# Altium project PCB_LED_CALENDAR.PrjPcb
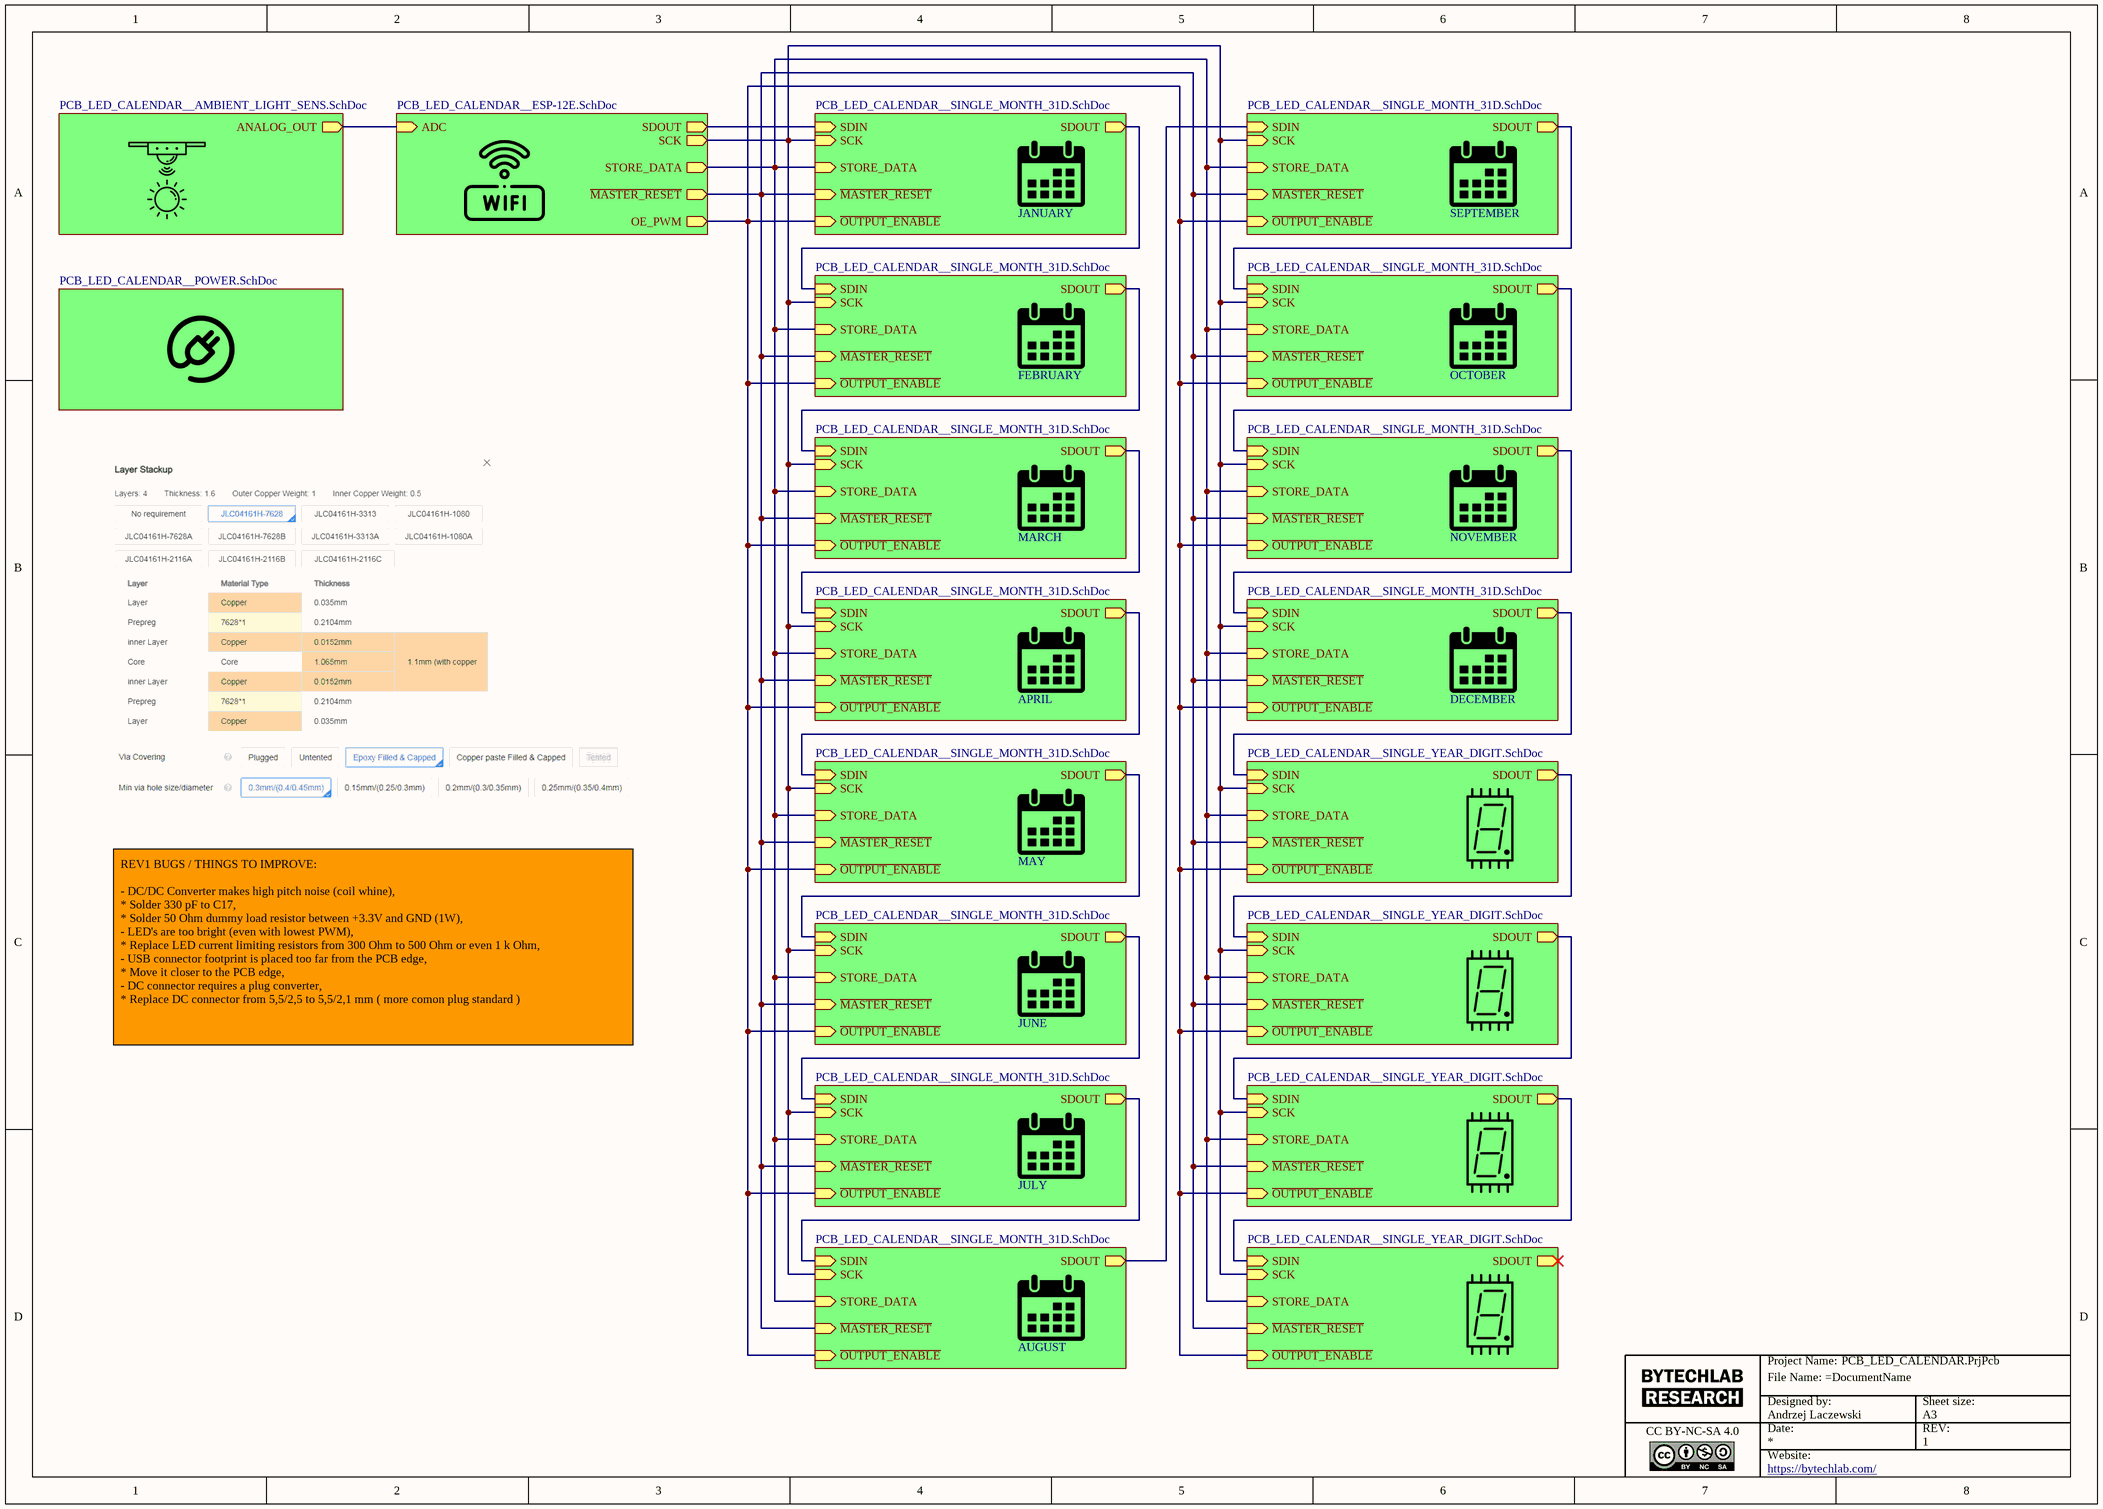
[diagram p0: PCB_LED_CALENDAR__MAIN.SchDoc]
AuthorGLobal: Andrzej Laczewski; CheckedByName: Adam Marszałek; Revision: 1; Title: LED CALENDAR
6 sheets, 947 parts. Net scope: hierarchical (ports join the sheet entries above them; power ports are global).
Board file: PCB_LED_CALENDAR.PcbDoc
Sheets:
  PCB_LED_CALENDAR__MAIN.SchDoc
    30D_3 = PCB_LED_CALENDAR__SINGLE_MONTH_31D.SchDoc
    31D_6 = PCB_LED_CALENDAR__SINGLE_MONTH_31D.SchDoc
    30D_4 = PCB_LED_CALENDAR__SINGLE_MONTH_31D.SchDoc
    31D_7 = PCB_LED_CALENDAR__SINGLE_MONTH_31D.SchDoc
    31D_5 = PCB_LED_CALENDAR__SINGLE_MONTH_31D.SchDoc
    31D_4 = PCB_LED_CALENDAR__SINGLE_MONTH_31D.SchDoc
    30D_2 = PCB_LED_CALENDAR__SINGLE_MONTH_31D.SchDoc
    31D_3 = PCB_LED_CALENDAR__SINGLE_MONTH_31D.SchDoc
    30D_1 = PCB_LED_CALENDAR__SINGLE_MONTH_31D.SchDoc
    31D_2 = PCB_LED_CALENDAR__SINGLE_MONTH_31D.SchDoc
    29D_1 = PCB_LED_CALENDAR__SINGLE_MONTH_31D.SchDoc
    31D_1 = PCB_LED_CALENDAR__SINGLE_MONTH_31D.SchDoc
    U_PCB_LED_CALENDAR__AMBIENT_LIGHT_SENS = PCB_LED_CALENDAR__AMBIENT_LIGHT_SENS.SchDoc
    U_PCB_LED_CALENDAR__POWER = PCB_LED_CALENDAR__POWER.SchDoc
    YD_1 = PCB_LED_CALENDAR__SINGLE_YEAR_DIGIT.SchDoc
    U_PCB_LED_CALENDAR__ESP-12E = PCB_LED_CALENDAR__ESP-12E.SchDoc
    YD_2 = PCB_LED_CALENDAR__SINGLE_YEAR_DIGIT.SchDoc
    YD_3 = PCB_LED_CALENDAR__SINGLE_YEAR_DIGIT.SchDoc
    YD_4 = PCB_LED_CALENDAR__SINGLE_YEAR_DIGIT.SchDoc

## Sheet PCB_LED_CALENDAR__MAIN.SchDoc: LED CALENDAR
size A3

### Sub-sheets
29D_1 = PCB_LED_CALENDAR__SINGLE_MONTH_31D.SchDoc: SDIN (in), SDOUT (out), ~{OUTPUT_ENABLE} (in), STORE_DATA (in), ~{MASTER_RESET} (in), SCK (in)
30D_1 = PCB_LED_CALENDAR__SINGLE_MONTH_31D.SchDoc: SDIN (in), SDOUT (out), ~{OUTPUT_ENABLE} (in), STORE_DATA (in), ~{MASTER_RESET} (in), SCK (in)
30D_2 = PCB_LED_CALENDAR__SINGLE_MONTH_31D.SchDoc: SDIN (in), SDOUT (out), ~{OUTPUT_ENABLE} (in), STORE_DATA (in), ~{MASTER_RESET} (in), SCK (in)
30D_3 = PCB_LED_CALENDAR__SINGLE_MONTH_31D.SchDoc: SDIN (in), SDOUT (out), ~{OUTPUT_ENABLE} (in), STORE_DATA (in), ~{MASTER_RESET} (in), SCK (in)
30D_4 = PCB_LED_CALENDAR__SINGLE_MONTH_31D.SchDoc: SDIN (in), SDOUT (out), ~{OUTPUT_ENABLE} (in), STORE_DATA (in), ~{MASTER_RESET} (in), SCK (in)
31D_1 = PCB_LED_CALENDAR__SINGLE_MONTH_31D.SchDoc: SDIN (in), SDOUT (out), ~{OUTPUT_ENABLE} (in), STORE_DATA (in), ~{MASTER_RESET} (in), SCK (in)
31D_2 = PCB_LED_CALENDAR__SINGLE_MONTH_31D.SchDoc: SDIN (in), SDOUT (out), ~{OUTPUT_ENABLE} (in), STORE_DATA (in), ~{MASTER_RESET} (in), SCK (in)
31D_3 = PCB_LED_CALENDAR__SINGLE_MONTH_31D.SchDoc: SDIN (in), SDOUT (out), ~{OUTPUT_ENABLE} (in), STORE_DATA (in), ~{MASTER_RESET} (in), SCK (in)
31D_4 = PCB_LED_CALENDAR__SINGLE_MONTH_31D.SchDoc: SDIN (in), SDOUT (out), ~{OUTPUT_ENABLE} (in), STORE_DATA (in), ~{MASTER_RESET} (in), SCK (in)
31D_5 = PCB_LED_CALENDAR__SINGLE_MONTH_31D.SchDoc: SDIN (in), SDOUT (out), ~{OUTPUT_ENABLE} (in), STORE_DATA (in), ~{MASTER_RESET} (in), SCK (in)
31D_6 = PCB_LED_CALENDAR__SINGLE_MONTH_31D.SchDoc: SDIN (in), SDOUT (out), ~{OUTPUT_ENABLE} (in), STORE_DATA (in), ~{MASTER_RESET} (in), SCK (in)
31D_7 = PCB_LED_CALENDAR__SINGLE_MONTH_31D.SchDoc: SDIN (in), SDOUT (out), ~{OUTPUT_ENABLE} (in), STORE_DATA (in), ~{MASTER_RESET} (in), SCK (in)
U_PCB_LED_CALENDAR__AMBIENT_LIGHT_SENS = PCB_LED_CALENDAR__AMBIENT_LIGHT_SENS.SchDoc: ANALOG_OUT (out)
U_PCB_LED_CALENDAR__ESP-12E = PCB_LED_CALENDAR__ESP-12E.SchDoc: ADC (in), SDOUT (out), SCK (out), OE_PWM (out), STORE_DATA (out), ~{MASTER_RESET} (out)
U_PCB_LED_CALENDAR__POWER = PCB_LED_CALENDAR__POWER.SchDoc: no entries
YD_1 = PCB_LED_CALENDAR__SINGLE_YEAR_DIGIT.SchDoc: SDIN (in), SDOUT (out), ~{OUTPUT_ENABLE} (in), STORE_DATA (in), ~{MASTER_RESET} (in), SCK (in)
YD_2 = PCB_LED_CALENDAR__SINGLE_YEAR_DIGIT.SchDoc: SDIN (in), SDOUT (out), ~{OUTPUT_ENABLE} (in), STORE_DATA (in), ~{MASTER_RESET} (in), SCK (in)
YD_3 = PCB_LED_CALENDAR__SINGLE_YEAR_DIGIT.SchDoc: SDIN (in), SDOUT (out), ~{OUTPUT_ENABLE} (in), STORE_DATA (in), ~{MASTER_RESET} (in), SCK (in)
YD_4 = PCB_LED_CALENDAR__SINGLE_YEAR_DIGIT.SchDoc: SDIN (in), SDOUT (out), ~{OUTPUT_ENABLE} (in), STORE_DATA (in), ~{MASTER_RESET} (in), SCK (in)

### Nets
NetMOD1_5: sheet 30D_3/SCK, sheet 31D_6/SCK, sheet 30D_4/SCK, sheet 31D_7/SCK, sheet 31D_5/SCK, sheet 31D_4/SCK, sheet 30D_2/SCK, sheet 31D_3/SCK, sheet 30D_1/SCK, sheet 31D_2/SCK, sheet 29D_1/SCK, sheet 31D_1/SCK, sheet YD_1/SCK, sheet U_PCB_LED_CALENDAR__ESP-12E/SCK, sheet YD_2/SCK, sheet YD_3/SCK, sheet YD_4/SCK
NetMOD1_6: sheet 30D_3/~{OUTPUT_ENABLE}, sheet 31D_6/~{OUTPUT_ENABLE}, sheet 30D_4/~{OUTPUT_ENABLE}, sheet 31D_7/~{OUTPUT_ENABLE}, sheet 31D_5/~{OUTPUT_ENABLE}, sheet 31D_4/~{OUTPUT_ENABLE}, sheet 30D_2/~{OUTPUT_ENABLE}, sheet 31D_3/~{OUTPUT_ENABLE}, sheet 30D_1/~{OUTPUT_ENABLE}, sheet 31D_2/~{OUTPUT_ENABLE}, sheet 29D_1/~{OUTPUT_ENABLE}, sheet 31D_1/~{OUTPUT_ENABLE}, sheet YD_1/~{OUTPUT_ENABLE}, sheet U_PCB_LED_CALENDAR__ESP-12E/OE_PWM, sheet YD_2/~{OUTPUT_ENABLE}, sheet YD_3/~{OUTPUT_ENABLE}, sheet YD_4/~{OUTPUT_ENABLE}
NetMOD1_7: sheet 31D_1/SDIN, sheet U_PCB_LED_CALENDAR__ESP-12E/SDOUT
NetMOD1_19: sheet 30D_3/~{MASTER_RESET}, sheet 31D_6/~{MASTER_RESET}, sheet 30D_4/~{MASTER_RESET}, sheet 31D_7/~{MASTER_RESET}, sheet 31D_5/~{MASTER_RESET}, sheet 31D_4/~{MASTER_RESET}, sheet 30D_2/~{MASTER_RESET}, sheet 31D_3/~{MASTER_RESET}, sheet 30D_1/~{MASTER_RESET}, sheet 31D_2/~{MASTER_RESET}, sheet 29D_1/~{MASTER_RESET}, sheet 31D_1/~{MASTER_RESET}, sheet YD_1/~{MASTER_RESET}, sheet U_PCB_LED_CALENDAR__ESP-12E/~{MASTER_RESET}, sheet YD_2/~{MASTER_RESET}, sheet YD_3/~{MASTER_RESET}, sheet YD_4/~{MASTER_RESET}
NetMOD1_20: sheet 30D_3/STORE_DATA, sheet 31D_6/STORE_DATA, sheet 30D_4/STORE_DATA, sheet 31D_7/STORE_DATA, sheet 31D_5/STORE_DATA, sheet 31D_4/STORE_DATA, sheet 30D_2/STORE_DATA, sheet 31D_3/STORE_DATA, sheet 30D_1/STORE_DATA, sheet 31D_2/STORE_DATA, sheet 29D_1/STORE_DATA, sheet 31D_1/STORE_DATA, sheet YD_1/STORE_DATA, sheet U_PCB_LED_CALENDAR__ESP-12E/STORE_DATA, sheet YD_2/STORE_DATA, sheet YD_3/STORE_DATA, sheet YD_4/STORE_DATA
NetQL1_2: sheet U_PCB_LED_CALENDAR__AMBIENT_LIGHT_SENS/ANALOG_OUT, sheet U_PCB_LED_CALENDAR__ESP-12E/ADC
NetU6_YD_1_9: sheet YD_1/SDOUT, sheet YD_2/SDIN
NetU6_YD_1_14: sheet 31D_7/SDOUT, sheet YD_1/SDIN
NetU6_YD_2_9: sheet YD_2/SDOUT, sheet YD_3/SDIN
NetU6_YD_3_9: sheet YD_3/SDOUT, sheet YD_4/SDIN
NetU12_29D_1_14: sheet 29D_1/SDIN, sheet 31D_1/SDOUT
NetU12_30D_1_14: sheet 30D_1/SDIN, sheet 31D_2/SDOUT
NetU12_30D_2_14: sheet 30D_2/SDIN, sheet 31D_3/SDOUT
NetU12_30D_3_14: sheet 30D_3/SDIN, sheet 31D_5/SDOUT
NetU12_30D_4_14: sheet 31D_6/SDOUT, sheet 30D_4/SDIN
NetU12_31D_2_14: sheet 31D_2/SDIN, sheet 29D_1/SDOUT
NetU12_31D_3_14: sheet 31D_3/SDIN, sheet 30D_1/SDOUT
NetU12_31D_4_14: sheet 31D_4/SDIN, sheet 30D_2/SDOUT
NetU12_31D_5_14: sheet 31D_5/SDIN, sheet 31D_4/SDOUT
NetU12_31D_6_14: sheet 30D_3/SDOUT, sheet 31D_6/SDIN
NetU12_31D_7_14: sheet 30D_4/SDOUT, sheet 31D_7/SDIN

### Notes on the sheet
- JANUARY
- SEPTEMBER
- FEBRUARY
- OCTOBER
- MARCH
- NOVEMBER
- APRIL
- DECEMBER
- MAY
- REV1 BUGS / THINGS TO IMPROVE:
  - DC/DC Converter makes high pitch noise (coil whine),
  * Solder 330 pF to C17,
  * Solder 50 Ohm dummy load resistor between +3.3V and GND (1W),
  - LED's are too bright (even with lowest PWM),
  * Replace LED current limiting resistors from 300 Ohm to 500 Ohm or even 1 k Ohm,
  - USB connector footprint is placed too far from the PCB edge,
  * Move it closer to the PCB edge,
  - DC connector requires a plug converter,
  * Replace DC connector from 5,5/2,5 to 5,5/2,1 mm ( more comon plug standard )
- JUNE
- JULY
- AUGUST
- Project Name:
- File Name: =DocumentName
- CC BY-NC-SA 4.0
- Designed by:
- Date:
- Website:
- Sheet size:
- A3
- REV:
- https://bytechlab.com/

## Sheet PCB_LED_CALENDAR__SINGLE_MONTH_31D.SchDoc: LED CALENDAR
size A3; Author: Andrzej Laczewski; DrawnBy: Andrzej Laczewski; SheetNumber: 3; SheetTotal: 4
Used 12 times, as channels 30D_3, 31D_6, 30D_4, 31D_7, 31D_5, 31D_4, 30D_2, 31D_3, 30D_1, 31D_2, 29D_1, 31D_1. Parts and nets are listed once, with the designators drawn on the sheet.
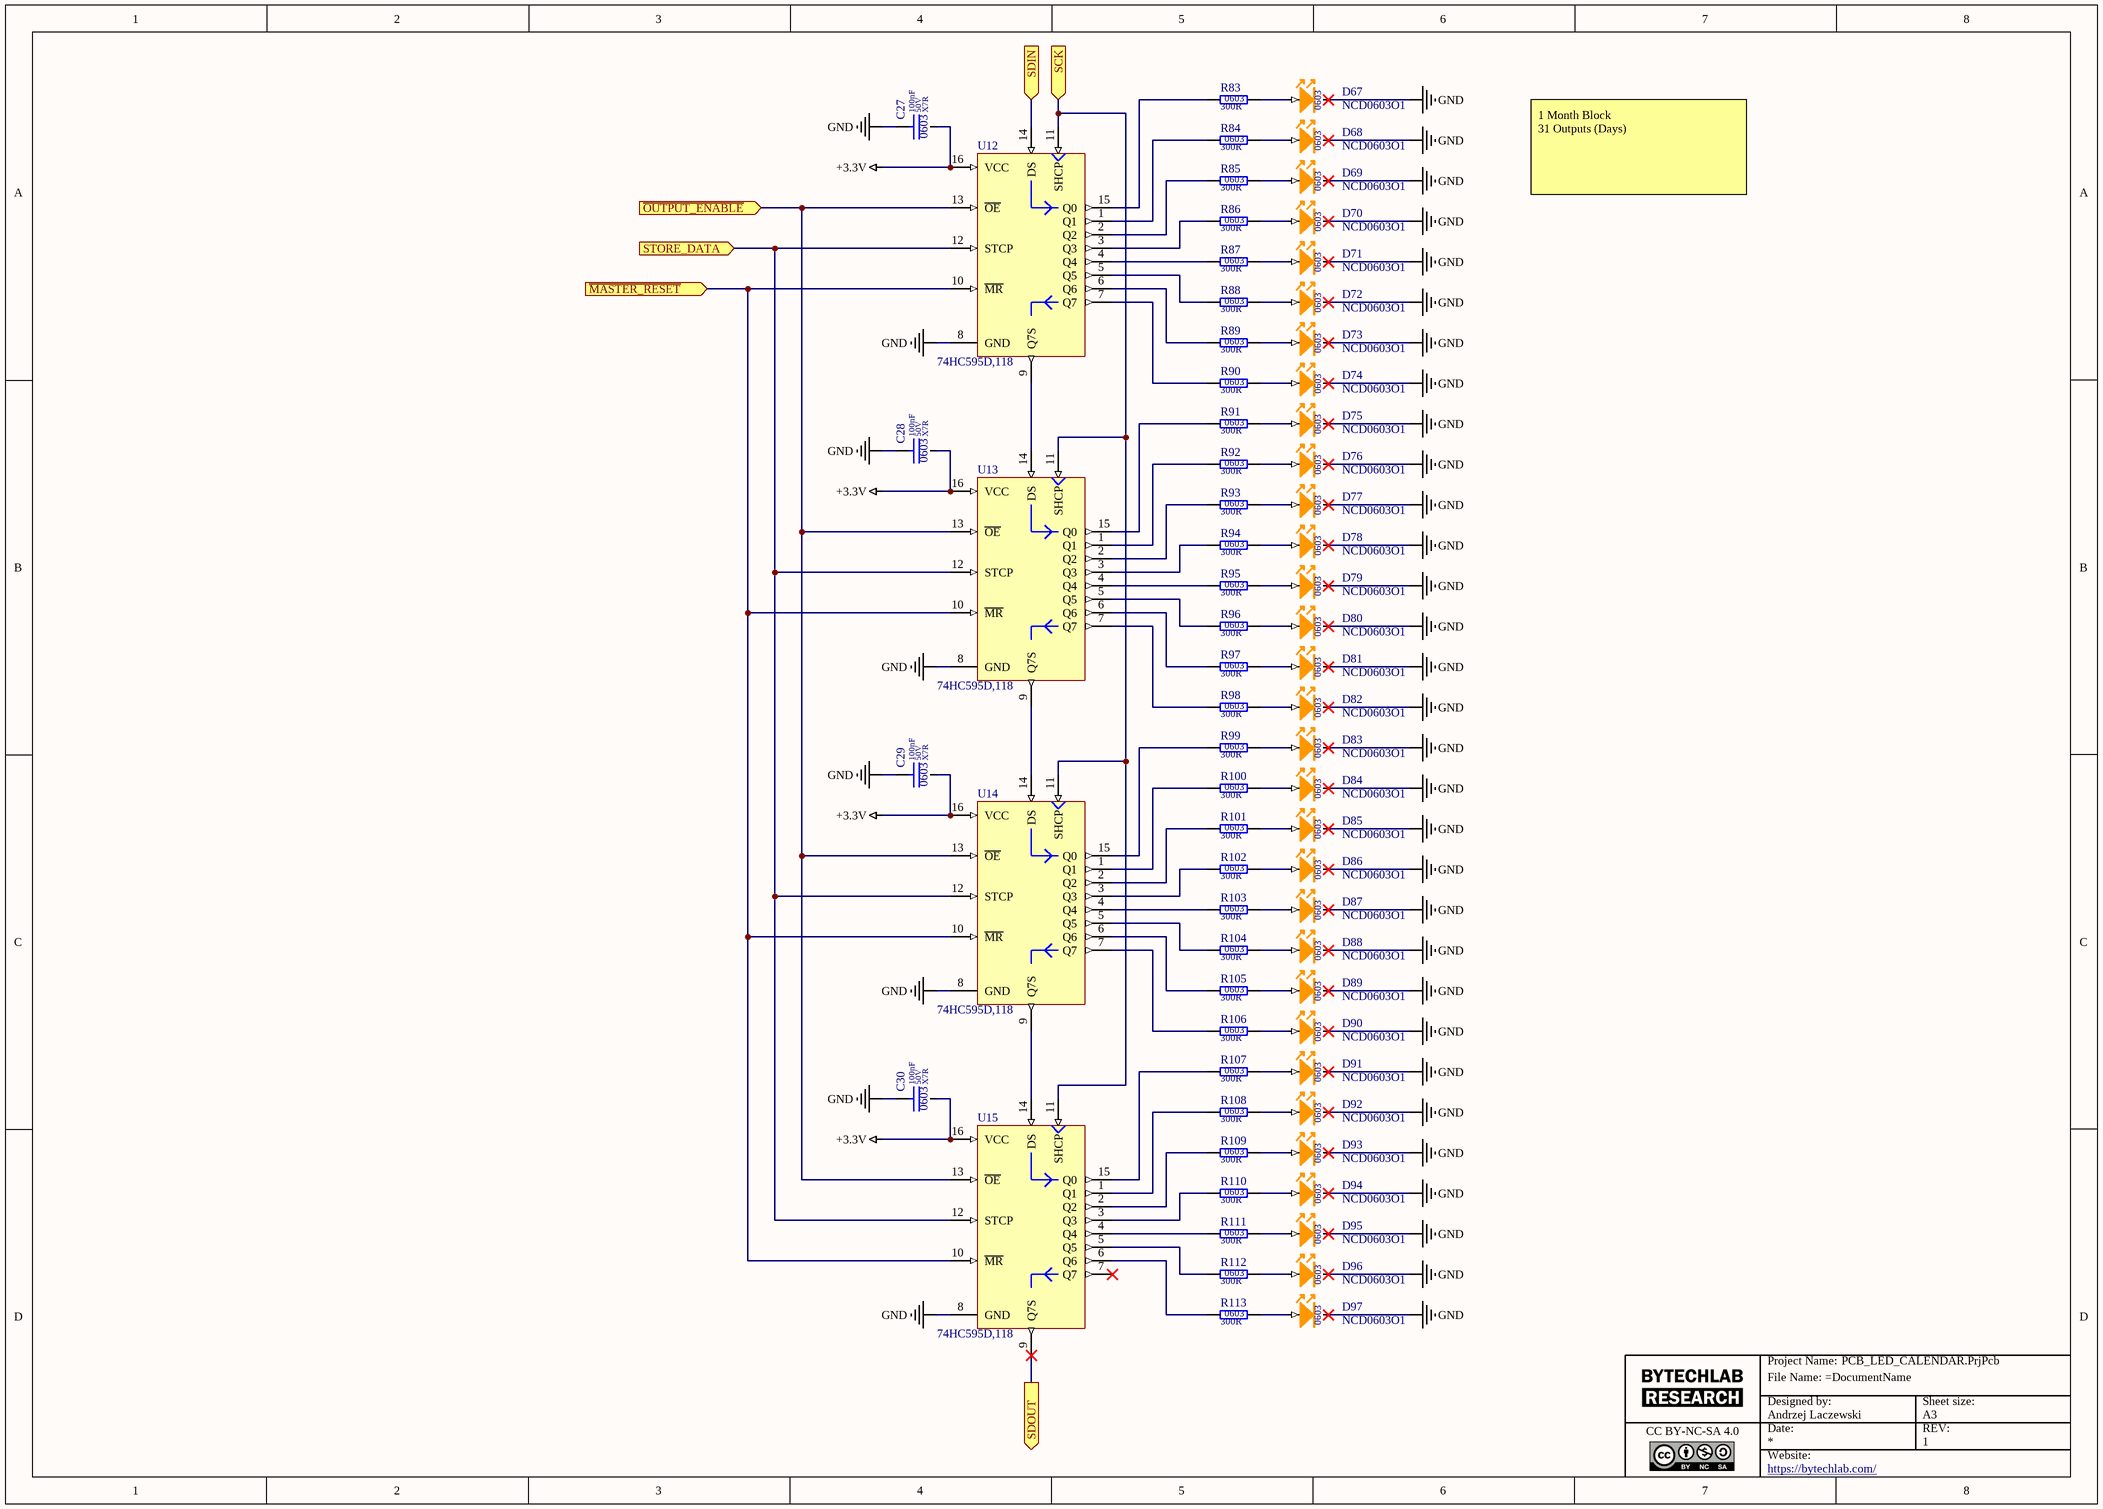
[diagram p1: PCB_LED_CALENDAR__SINGLE_MONTH_31D.SchDoc]

### Parts
C27  value 100nF  Dielectric: X7R  Voltage: 50V  SCH_Footprint: 0603  [C_0603_1608]  (hidden comment: Ceramic X7R)
C28  value 100nF  Dielectric: X7R  Voltage: 50V  SCH_Footprint: 0603  [C_0603_1608]  (hidden comment: Ceramic X7R)
C29  value 100nF  Dielectric: X7R  Voltage: 50V  SCH_Footprint: 0603  [C_0603_1608]  (hidden comment: Ceramic X7R)
C30  value 100nF  Dielectric: X7R  Voltage: 50V  SCH_Footprint: 0603  [C_0603_1608]  (hidden comment: Ceramic X7R)
D67  NCD0603O1  SCH_Footprint: 0603  [LED_0603]
D68  NCD0603O1  SCH_Footprint: 0603  [LED_0603]
D69  NCD0603O1  SCH_Footprint: 0603  [LED_0603]
D70  NCD0603O1  SCH_Footprint: 0603  [LED_0603]
D71  NCD0603O1  SCH_Footprint: 0603  [LED_0603]
D72  NCD0603O1  SCH_Footprint: 0603  [LED_0603]
D73  NCD0603O1  SCH_Footprint: 0603  [LED_0603]
D74  NCD0603O1  SCH_Footprint: 0603  [LED_0603]
D75  NCD0603O1  SCH_Footprint: 0603  [LED_0603]
D76  NCD0603O1  SCH_Footprint: 0603  [LED_0603]
D77  NCD0603O1  SCH_Footprint: 0603  [LED_0603]
D78  NCD0603O1  SCH_Footprint: 0603  [LED_0603]
D79  NCD0603O1  SCH_Footprint: 0603  [LED_0603]
D80  NCD0603O1  SCH_Footprint: 0603  [LED_0603]
D81  NCD0603O1  SCH_Footprint: 0603  [LED_0603]
D82  NCD0603O1  SCH_Footprint: 0603  [LED_0603]
D83  NCD0603O1  SCH_Footprint: 0603  [LED_0603]
D84  NCD0603O1  SCH_Footprint: 0603  [LED_0603]
D85  NCD0603O1  SCH_Footprint: 0603  [LED_0603]
D86  NCD0603O1  SCH_Footprint: 0603  [LED_0603]
D87  NCD0603O1  SCH_Footprint: 0603  [LED_0603]
D88  NCD0603O1  SCH_Footprint: 0603  [LED_0603]
D89  NCD0603O1  SCH_Footprint: 0603  [LED_0603]
D90  NCD0603O1  SCH_Footprint: 0603  [LED_0603]
D91  NCD0603O1  SCH_Footprint: 0603  [LED_0603]
D92  NCD0603O1  SCH_Footprint: 0603  [LED_0603]
D93  NCD0603O1  SCH_Footprint: 0603  [LED_0603]
D94  NCD0603O1  SCH_Footprint: 0603  [LED_0603]
D95  NCD0603O1  SCH_Footprint: 0603  [LED_0603]
D96  NCD0603O1  SCH_Footprint: 0603  [LED_0603]
D97  NCD0603O1  SCH_Footprint: 0603  [LED_0603]
R83  value 300R  SCH_Footprint: 0603  [R_0603_1608]  (hidden comment: Resistor)
R84  value 300R  SCH_Footprint: 0603  [R_0603_1608]  (hidden comment: Resistor)
R85  value 300R  SCH_Footprint: 0603  [R_0603_1608]  (hidden comment: Resistor)
R86  value 300R  SCH_Footprint: 0603  [R_0603_1608]  (hidden comment: Resistor)
R87  value 300R  SCH_Footprint: 0603  [R_0603_1608]  (hidden comment: Resistor)
R88  value 300R  SCH_Footprint: 0603  [R_0603_1608]  (hidden comment: Resistor)
R89  value 300R  SCH_Footprint: 0603  [R_0603_1608]  (hidden comment: Resistor)
R90  value 300R  SCH_Footprint: 0603  [R_0603_1608]  (hidden comment: Resistor)
R91  value 300R  SCH_Footprint: 0603  [R_0603_1608]  (hidden comment: Resistor)
R92  value 300R  SCH_Footprint: 0603  [R_0603_1608]  (hidden comment: Resistor)
R93  value 300R  SCH_Footprint: 0603  [R_0603_1608]  (hidden comment: Resistor)
R94  value 300R  SCH_Footprint: 0603  [R_0603_1608]  (hidden comment: Resistor)
R95  value 300R  SCH_Footprint: 0603  [R_0603_1608]  (hidden comment: Resistor)
R96  value 300R  SCH_Footprint: 0603  [R_0603_1608]  (hidden comment: Resistor)
R97  value 300R  SCH_Footprint: 0603  [R_0603_1608]  (hidden comment: Resistor)
R98  value 300R  SCH_Footprint: 0603  [R_0603_1608]  (hidden comment: Resistor)
R99  value 300R  SCH_Footprint: 0603  [R_0603_1608]  (hidden comment: Resistor)
R100  value 300R  SCH_Footprint: 0603  [R_0603_1608]  (hidden comment: Resistor)
R101  value 300R  SCH_Footprint: 0603  [R_0603_1608]  (hidden comment: Resistor)
R102  value 300R  SCH_Footprint: 0603  [R_0603_1608]  (hidden comment: Resistor)
R103  value 300R  SCH_Footprint: 0603  [R_0603_1608]  (hidden comment: Resistor)
R104  value 300R  SCH_Footprint: 0603  [R_0603_1608]  (hidden comment: Resistor)
R105  value 300R  SCH_Footprint: 0603  [R_0603_1608]  (hidden comment: Resistor)
R106  value 300R  SCH_Footprint: 0603  [R_0603_1608]  (hidden comment: Resistor)
R107  value 300R  SCH_Footprint: 0603  [R_0603_1608]  (hidden comment: Resistor)
R108  value 300R  SCH_Footprint: 0603  [R_0603_1608]  (hidden comment: Resistor)
R109  value 300R  SCH_Footprint: 0603  [R_0603_1608]  (hidden comment: Resistor)
R110  value 300R  SCH_Footprint: 0603  [R_0603_1608]  (hidden comment: Resistor)
R111  value 300R  SCH_Footprint: 0603  [R_0603_1608]  (hidden comment: Resistor)
R112  value 300R  SCH_Footprint: 0603  [R_0603_1608]  (hidden comment: Resistor)
R113  value 300R  SCH_Footprint: 0603  [R_0603_1608]  (hidden comment: Resistor)
U12  74HC595D,118  [SO16]
U13  74HC595D,118  [SO16]
U14  74HC595D,118  [SO16]
U15  74HC595D,118  [SO16]

### Ports
SCK (in), SDIN (in), SDOUT (out), STORE_DATA (in), ~{MASTER_RESET} (in), ~{OUTPUT_ENABLE} (in)

### Nets
+3.3V: C27.2 C28.2 C29.2 C30.2 U12.16(VCC) U13.16(VCC) U14.16(VCC) U15.16(VCC)
GND: C27.1 C28.1 C29.1 C30.1 D67.1(K) D68.1(K) D69.1(K) D70.1(K) D71.1(K) D72.1(K) D73.1(K) D74.1(K) D75.1(K) D76.1(K) D77.1(K) D78.1(K) D79.1(K) D80.1(K) D81.1(K) D82.1(K) D83.1(K) D84.1(K) D85.1(K) D86.1(K) D87.1(K) D88.1(K) D89.1(K) D90.1(K) D91.1(K) D92.1(K) D93.1(K) D94.1(K) D95.1(K) D96.1(K) D97.1(K) U12.8(GND) U13.8(GND) U14.8(GND) U15.8(GND)
~{MASTER_RESET}: U12.10(~{MR}) U13.10(~{MR}) U14.10(~{MR}) U15.10(~{MR}) ; port ~{MASTER_RESET}
~{OUTPUT_ENABLE}: U12.13(~{OE}) U13.13(~{OE}) U14.13(~{OE}) U15.13(~{OE}) ; port ~{OUTPUT_ENABLE}
SCK: U12.11(SHCP) U13.11(SHCP) U14.11(SHCP) U15.11(SHCP) ; port SCK
SDIN: U12.14(DS) ; port SDIN
SDOUT: U15.9(Q7S) ; port SDOUT
STORE_DATA: U12.12(STCP) U13.12(STCP) U14.12(STCP) U15.12(STCP) ; port STORE_DATA
NetD67_2: D67.2(A) R83.2
NetD68_2: D68.2(A) R84.2
NetD69_2: D69.2(A) R85.2
NetD70_2: D70.2(A) R86.2
NetD71_2: D71.2(A) R87.2
NetD72_2: D72.2(A) R88.2
NetD73_2: D73.2(A) R89.2
NetD74_2: D74.2(A) R90.2
NetD75_2: D75.2(A) R91.2
NetD76_2: D76.2(A) R92.2
NetD77_2: D77.2(A) R93.2
NetD78_2: D78.2(A) R94.2
NetD79_2: D79.2(A) R95.2
NetD80_2: D80.2(A) R96.2
NetD81_2: D81.2(A) R97.2
NetD82_2: D82.2(A) R98.2
NetD83_2: D83.2(A) R99.2
NetD84_2: D84.2(A) R100.2
NetD85_2: D85.2(A) R101.2
NetD86_2: D86.2(A) R102.2
NetD87_2: D87.2(A) R103.2
NetD88_2: D88.2(A) R104.2
NetD89_2: D89.2(A) R105.2
NetD90_2: D90.2(A) R106.2
NetD91_2: D91.2(A) R107.2
NetD92_2: D92.2(A) R108.2
NetD93_2: D93.2(A) R109.2
NetD94_2: D94.2(A) R110.2
NetD95_2: D95.2(A) R111.2
NetD96_2: D96.2(A) R112.2
NetD97_2: D97.2(A) R113.2
NetR83_1: R83.1 U12.15(Q0)
NetR84_1: R84.1 U12.1(Q1)
NetR85_1: R85.1 U12.2(Q2)
NetR86_1: R86.1 U12.3(Q3)
NetR87_1: R87.1 U12.4(Q4)
NetR88_1: R88.1 U12.5(Q5)
NetR89_1: R89.1 U12.6(Q6)
NetR90_1: R90.1 U12.7(Q7)
NetR91_1: R91.1 U13.15(Q0)
NetR92_1: R92.1 U13.1(Q1)
NetR93_1: R93.1 U13.2(Q2)
NetR94_1: R94.1 U13.3(Q3)
NetR95_1: R95.1 U13.4(Q4)
NetR96_1: R96.1 U13.5(Q5)
NetR97_1: R97.1 U13.6(Q6)
NetR98_1: R98.1 U13.7(Q7)
NetR99_1: R99.1 U14.15(Q0)
NetR100_1: R100.1 U14.1(Q1)
NetR101_1: R101.1 U14.2(Q2)
NetR102_1: R102.1 U14.3(Q3)
NetR103_1: R103.1 U14.4(Q4)
NetR104_1: R104.1 U14.5(Q5)
NetR105_1: R105.1 U14.6(Q6)
NetR106_1: R106.1 U14.7(Q7)
NetR107_1: R107.1 U15.15(Q0)
NetR108_1: R108.1 U15.1(Q1)
NetR109_1: R109.1 U15.2(Q2)
NetR110_1: R110.1 U15.3(Q3)
NetR111_1: R111.1 U15.4(Q4)
NetR112_1: R112.1 U15.5(Q5)
NetR113_1: R113.1 U15.6(Q6)
NetU12_9: U12.9(Q7S) U13.14(DS)
NetU13_9: U13.9(Q7S) U14.14(DS)
NetU14_9: U14.9(Q7S) U15.14(DS)

Not connected (* = marked no-connect by the designer): U15 7(Q7)*

### Channels
30D_3: designators end in _30D_3; ports SCK=NetMOD1_5 SDIN=NetU12_30D_3_14 SDOUT=NetU12_31D_6_14 STORE_DATA=NetMOD1_20 ~{MASTER_RESET}=NetMOD1_19 ~{OUTPUT_ENABLE}=NetMOD1_6
31D_6: designators end in _31D_6; ports SCK=NetMOD1_5 SDIN=NetU12_31D_6_14 SDOUT=NetU12_30D_4_14 STORE_DATA=NetMOD1_20 ~{MASTER_RESET}=NetMOD1_19 ~{OUTPUT_ENABLE}=NetMOD1_6
30D_4: designators end in _30D_4; ports SCK=NetMOD1_5 SDIN=NetU12_30D_4_14 SDOUT=NetU12_31D_7_14 STORE_DATA=NetMOD1_20 ~{MASTER_RESET}=NetMOD1_19 ~{OUTPUT_ENABLE}=NetMOD1_6
31D_7: designators end in _31D_7; ports SCK=NetMOD1_5 SDIN=NetU12_31D_7_14 SDOUT=NetU6_YD_1_14 STORE_DATA=NetMOD1_20 ~{MASTER_RESET}=NetMOD1_19 ~{OUTPUT_ENABLE}=NetMOD1_6
31D_5: designators end in _31D_5; ports SCK=NetMOD1_5 SDIN=NetU12_31D_5_14 SDOUT=NetU12_30D_3_14 STORE_DATA=NetMOD1_20 ~{MASTER_RESET}=NetMOD1_19 ~{OUTPUT_ENABLE}=NetMOD1_6
31D_4: designators end in _31D_4; ports SCK=NetMOD1_5 SDIN=NetU12_31D_4_14 SDOUT=NetU12_31D_5_14 STORE_DATA=NetMOD1_20 ~{MASTER_RESET}=NetMOD1_19 ~{OUTPUT_ENABLE}=NetMOD1_6
30D_2: designators end in _30D_2; ports SCK=NetMOD1_5 SDIN=NetU12_30D_2_14 SDOUT=NetU12_31D_4_14 STORE_DATA=NetMOD1_20 ~{MASTER_RESET}=NetMOD1_19 ~{OUTPUT_ENABLE}=NetMOD1_6
31D_3: designators end in _31D_3; ports SCK=NetMOD1_5 SDIN=NetU12_31D_3_14 SDOUT=NetU12_30D_2_14 STORE_DATA=NetMOD1_20 ~{MASTER_RESET}=NetMOD1_19 ~{OUTPUT_ENABLE}=NetMOD1_6
30D_1: designators end in _30D_1; ports SCK=NetMOD1_5 SDIN=NetU12_30D_1_14 SDOUT=NetU12_31D_3_14 STORE_DATA=NetMOD1_20 ~{MASTER_RESET}=NetMOD1_19 ~{OUTPUT_ENABLE}=NetMOD1_6
31D_2: designators end in _31D_2; ports SCK=NetMOD1_5 SDIN=NetU12_31D_2_14 SDOUT=NetU12_30D_1_14 STORE_DATA=NetMOD1_20 ~{MASTER_RESET}=NetMOD1_19 ~{OUTPUT_ENABLE}=NetMOD1_6
29D_1: designators end in _29D_1; ports SCK=NetMOD1_5 SDIN=NetU12_29D_1_14 SDOUT=NetU12_31D_2_14 STORE_DATA=NetMOD1_20 ~{MASTER_RESET}=NetMOD1_19 ~{OUTPUT_ENABLE}=NetMOD1_6
31D_1: designators end in _31D_1; ports SCK=NetMOD1_5 SDIN=NetMOD1_7 SDOUT=NetU12_29D_1_14 STORE_DATA=NetMOD1_20 ~{MASTER_RESET}=NetMOD1_19 ~{OUTPUT_ENABLE}=NetMOD1_6

### Notes on the sheet
- 1 Month Block
  31 Outputs (Days)
- Project Name:
- File Name: =DocumentName
- CC BY-NC-SA 4.0
- Designed by:
- Date:
- Website:
- Sheet size:
- A3
- REV:
- https://bytechlab.com/
- Title:
- from project
- Sheet:
- of
- Revision
- Author:
- File name:
- Checked by:
- Size:
- A2
- Approved by:

### Library data of the parts
C27-C30 = C_100nF_50V_X7R_0603_5: Capacitor; Manufacturer: Samsung; Manufacturer Part Number: CL10B104JB8NNNC; Tolerance (%): 5; Part Number: C_100nF_50V_X7R_0603_5; HelpURL: http://www.tme.eu/pl/Document/4a42202b32dab16128fe107dd69598cc/samsung-chip-cap.pdf; Supplier 1: TME; Supplier Part Number 1: CL10B104JB8NNNC; Supplier 2: RS Components; Supplier Part Number 2: 7665455; Supplier 3: Farnell; Supplier 4: Mouser; Supplier 5: Digi-Key; Supplier Part Number 5: 1276-1033-1-ND; Supplier 6: LCSC; Supplier Part Number 6: C24452
D67-D97 = OL_NCD0603O1: Orange 130° 65mW 1.6V~2.6V 0603; Manufacturer: Foshan NationStar Optoelectronics; Manufacturer Part Number: NCD0603O1; Supplier 1: JLCPCB; Supplier Part Number 1: C84269
R83-R113 = R_300R_0603_1: Manufacturer: Yageo; Manufacturer Part Number: RC0603FR-07300RL; Voltage: 50V; Power: 100mW; Tolerance: 1%; Part Number: R_300R_0603_1; HelpURL: https://www.tme.eu/Document/d2a72e545e5c8eb7bf2a04fa97535928/rc0603yageo.pdf; Supplier 1: TME; Supplier Part Number 1: RC0603FR-07300R; Supplier 2: RS Components; Supplier 3: Farnell; Supplier Part Number 3: 2413696; Supplier 4: Mouser; Supplier Part Number 4: 603-RC0603FR-07300RL; Supplier 5: Digi-Key; Supplier Part Number 5: 311-300HRCT-ND; Supplier 6: LCSC
U12-U15 = U_74HC595D,118: 8-bit serial-in, serial or parallel-out shift register with output latches; 3-state; Manufacturer: Nexperia; Manufacturer Part Number: 74HC595D,118; Supplier 1: JLCPCB; Supplier Part Number 1: C5947

## Sheet PCB_LED_CALENDAR__AMBIENT_LIGHT_SENS.SchDoc: LED CALENDAR
size A4
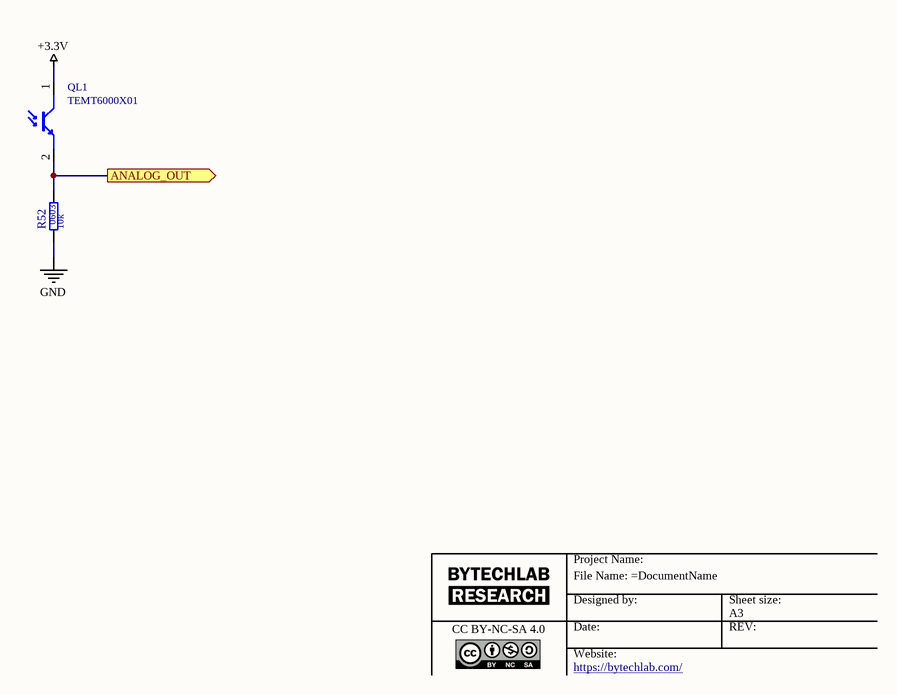
[diagram p2: PCB_LED_CALENDAR__AMBIENT_LIGHT_SENS.SchDoc]

### Parts
QL1  TEMT6000X01  [TEMT6000X01]
R52  value 10k  SCH_Footprint: 0603  [R_0603_1608]  (hidden comment: Resistor)

### Ports
ANALOG_OUT (out)

### Nets
+3.3V: QL1.1
GND: R52.1
NetQL1_2: QL1.2 R52.2 ; port ANALOG_OUT

### Notes on the sheet
- Project Name:
- File Name: =DocumentName
- CC BY-NC-SA 4.0
- Designed by:
- Date:
- Website:
- Sheet size:
- A3
- REV:
- https://bytechlab.com/

### Library data of the parts
QL1 = QL_TEMT6000X01: 1206 Ambient Light Sensors ROHS; Manufacturer: Vishay Intertech; Manufacturer Part Number: TEMT6000X01; Supplier 1: JLCPCB; Supplier Part Number 1: C94098
R52 = R_10k_0603_1: Manufacturer: Vishay; Manufacturer Part Number: CRCW060310K0FKTA; Voltage: 75V; Power: 100mW; Tolerance: 1%; Part Number: R_10k_0603_1; HelpURL: https://octopart.com/datasheet/crcw060310k0fkta-vishay-39447548; Supplier 1: TME; Supplier Part Number 1: CRCW060310K0FKTABC; Supplier 2: RS Components; Supplier 3: Farnell; Supplier Part Number 3: 1652827; Supplier 4: Mouser; Supplier Part Number 4: 71-CRCW0603-10K; Supplier 5: Digi-Key; Supplier Part Number 5: 541-2980-1-ND; Supplier 6: LCSC

## Sheet PCB_LED_CALENDAR__POWER.SchDoc: LED CALENDAR
size A4
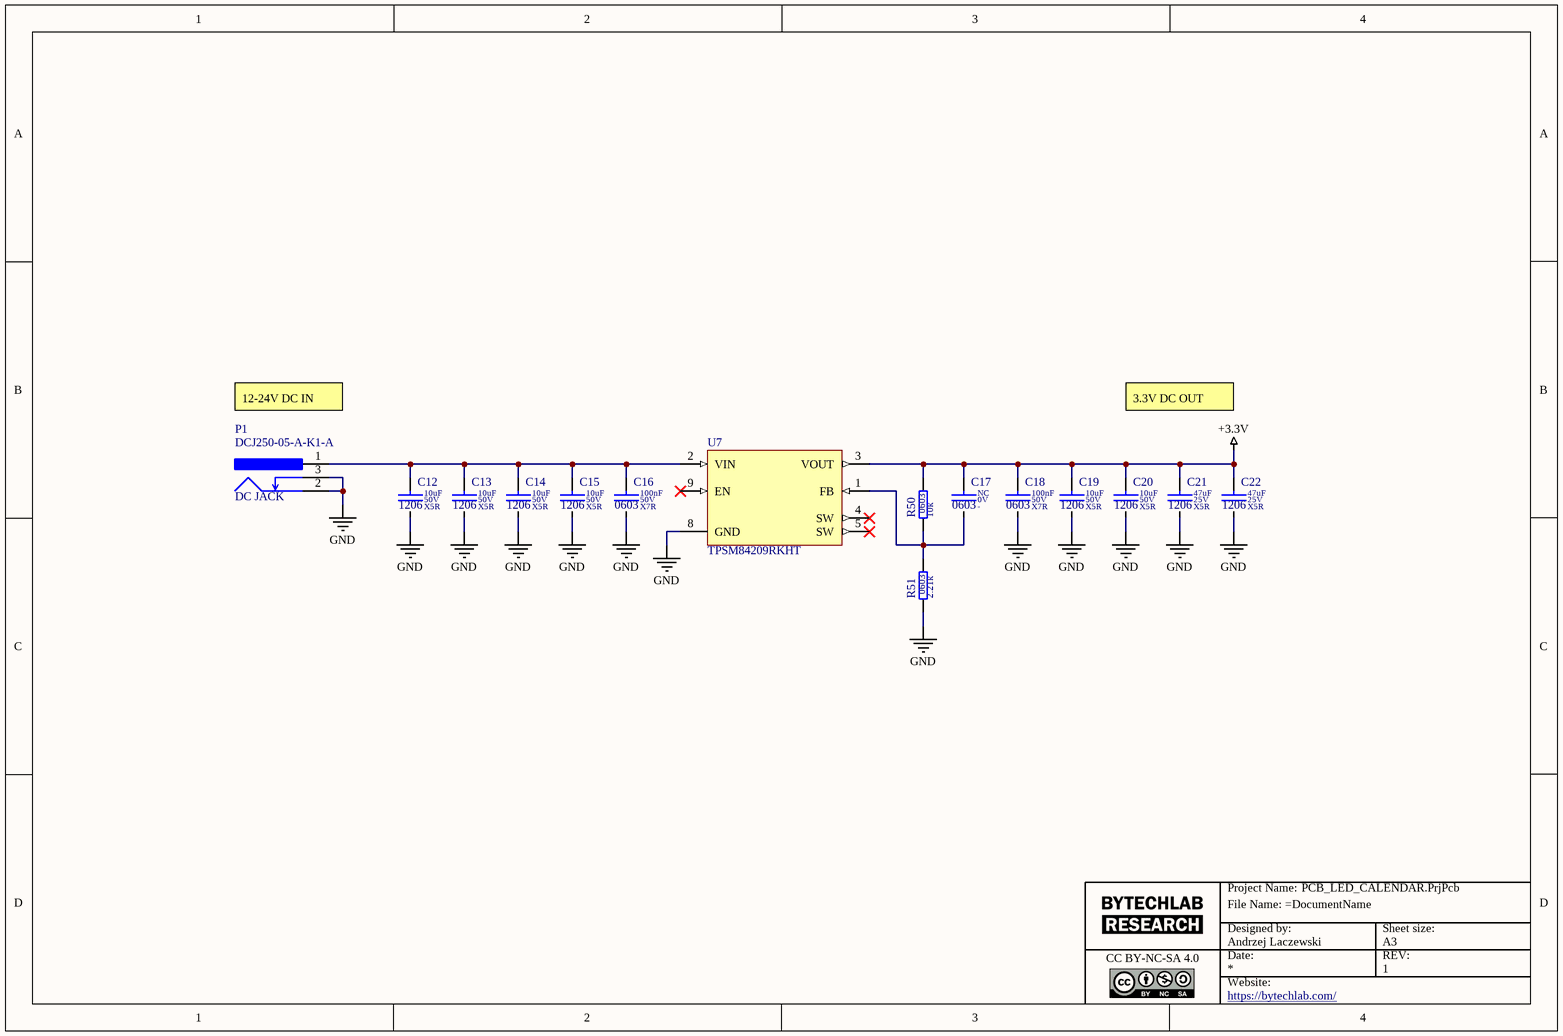
[diagram p3: PCB_LED_CALENDAR__POWER.SchDoc]

### Parts
C12  value 10uF  Dielectric: X5R  Voltage: 50V  SCH_Footprint: 1206  [C_1206_3216]  (hidden comment: Ceramic X5R)
C13  value 10uF  Dielectric: X5R  Voltage: 50V  SCH_Footprint: 1206  [C_1206_3216]  (hidden comment: Ceramic X5R)
C14  value 10uF  Dielectric: X5R  Voltage: 50V  SCH_Footprint: 1206  [C_1206_3216]  (hidden comment: Ceramic X5R)
C15  value 10uF  Dielectric: X5R  Voltage: 50V  SCH_Footprint: 1206  [C_1206_3216]  (hidden comment: Ceramic X5R)
C16  value 100nF  Dielectric: X7R  Voltage: 50V  SCH_Footprint: 0603  [C_0603_1608]  (hidden comment: Ceramic X7R)
C17  value NC  Voltage: 0V  SCH_Footprint: 0603  [C_NC_0603_1608]  (hidden comment: -)
C18  value 100nF  Dielectric: X7R  Voltage: 50V  SCH_Footprint: 0603  [C_0603_1608]  (hidden comment: Ceramic X7R)
C19  value 10uF  Dielectric: X5R  Voltage: 50V  SCH_Footprint: 1206  [C_1206_3216]  (hidden comment: Ceramic X5R)
C20  value 10uF  Dielectric: X5R  Voltage: 50V  SCH_Footprint: 1206  [C_1206_3216]  (hidden comment: Ceramic X5R)
C21  value 47uF  Dielectric: X5R  Voltage: 25V  SCH_Footprint: 1206  [C_1206_3216]  (hidden comment: Ceramic X5R)
C22  value 47uF  Dielectric: X5R  Voltage: 25V  SCH_Footprint: 1206  [C_1206_3216]  (hidden comment: Ceramic X5R)
P1  value DCJ250-05-A-K1-A  SCH_Footprint: DC JACK  [P_DCJ250-05-A-K1-A]  (hidden comment: DC Power Connectors DC Power Jack, SMT, Horizontal, with pegs)
R50  value 10k  SCH_Footprint: 0603  [R_0603_1608]  (hidden comment: Resistor)
R51  value 2.21k  SCH_Footprint: 0603  [R_0603_1608]  (hidden comment: Resistor)
U7  TPSM84209RKHT  [QFN9_4.5x4]

### Nets
+3.3V: C17.1 C18.1 C19.1 C20.1 C21.1 C22.1 R50.2 U7.3(VOUT)
GND: C12.2 C13.2 C14.2 C15.2 C16.2 C18.2 C19.2 C20.2 C21.2 C22.2 P1.2 P1.3 R51.1 U7.8(GND)
NetC12_1: C12.1 C13.1 C14.1 C15.1 C16.1 P1.1 U7.2(VIN)
NetC17_2: C17.2 R50.1 R51.2 U7.1(FB)

Not connected (* = marked no-connect by the designer): U7 4(SW)* 5(SW)* 6(DNC) 7(DNC) 9(EN)*

### Notes on the sheet
- 12-24V DC IN
- 3.3V DC OUT
- Project Name:
- File Name: =DocumentName
- CC BY-NC-SA 4.0
- Designed by:
- Date:
- Website:
- Sheet size:
- A3
- REV:
- https://bytechlab.com/

### Library data of the parts
C12-C15 C19 C20 = C_10uF_50V_X5R_1206_10: Capacitor; Manufacturer: Murata; Manufacturer Part Number: GRT31CR61H106KE01L; Tolerance (%): 10; Part Number: C_10uF_50V_X5R_1206_10; HelpURL: https://www.mouser.pl/datasheet/2/281/1/GRT31CR61H106KE01_01A-3158417.pdf; Supplier 1: TME; Supplier Part Number 1: GRT31CR61H106KE01L; Supplier 2: RS Components; Supplier Part Number 2: 1656426; Supplier 3: Farnell; Supplier Part Number 3: 2672214; Supplier 4: Mouser; Supplier Part Number 4: 81-GRT31CR61H106KE1L; Supplier 5: Digi-Key; Supplier Part Number 5: 490-12456-1-ND; Supplier 6: LCSC
C16 C18 = C_100nF_50V_X7R_0603_5: as C27 on sheet PCB_LED_CALENDAR__SINGLE_MONTH_31D; Part Number: C_100nF_50V_X7R_0603_5; HelpURL: http://www.tme.eu/pl/Document/4a42202b32dab16128fe107dd69598cc/samsung-chip-cap.pdf; Supplier 1: TME; Supplier Part Number 1: CL10B104JB8NNNC; Supplier 2: RS Components; Supplier Part Number 2: 7665455; Supplier 3: Farnell; Supplier 4: Mouser; Supplier 5: Digi-Key; Supplier Part Number 5: 1276-1033-1-ND; Supplier 6: LCSC; Supplier Part Number 6: C24452
C17 = C_GENERIC_0603: Capacitor; Tolerance (%): 0; Dielectric: -; Part Number: C_GENERIC_0603; HelpURL: -; Manufacturer: -; Manufacturer Part Number: -; Supplier 1: TME; Supplier 2: RS Components; Supplier 3: Farnell; Supplier 4: Mouser; Supplier 5: Digi-Key; Supplier 6: LCSC
C21 C22 = C_47uF_25V_X5R_1206_20: Capacitor; Manufacturer: TDK; Manufacturer Part Number: C3216X5R1E476M160AC; Tolerance (%): 20; Part Number: C_47uF_25V_X5R_1206_20; HelpURL: https://product.tdk.com/system/files/dam/doc/product/capacitor/ceramic/mlcc/catalog/mlcc_commercial_general_en.pdf; Supplier 1: TME; Supplier Part Number 1: C3216X5R1E476MAC; Supplier 2: RS Components; Supplier Part Number 2: 7883060P; Supplier 3: Farnell; Supplier Part Number 3: 2525172; Supplier 4: Mouser; Supplier Part Number 4: 810-C3216X5R1E476M; Supplier 5: Digi-Key; Supplier Part Number 5: 445-8047-1-ND; Supplier 6: LCSC
P1 = P_DCJ250-05-A-K1-A: Typical 3-pin jack power connector with switch; Manufacturer: GCT; Part Number: P_DCJ250-05-A-K1-A; HelpURL: https://gct.co/files/drawings/dcj250-05.pdf?v=cff2b182-97b3-411d-910e-e1786ab477e1; Manufacturer Part Number: DCJ250-05-A-K1-A; Supplier 1: TME; Supplier Part Number 1: DCJ250-05-A-K1-A; Supplier 2: RS Components; Supplier 3: Farnell; Supplier Part Number 3: 3873256; Supplier 4: Mouser; Supplier Part Number 4: 640-DCJ250-05-A-K1-A; Supplier 5: Digi-Key; Supplier Part Number 5: 2073-DCJ250-05-A-K1-ACT-ND; Supplier 6: LCSC
R50 = R_10k_0603_1: as R52 on sheet PCB_LED_CALENDAR__AMBIENT_LIGHT_SENS; Part Number: R_10k_0603_1; HelpURL: https://octopart.com/datasheet/crcw060310k0fkta-vishay-39447548; Supplier 1: TME; Supplier Part Number 1: CRCW060310K0FKTABC; Supplier 2: RS Components; Supplier 3: Farnell; Supplier Part Number 3: 1652827; Supplier 4: Mouser; Supplier Part Number 4: 71-CRCW0603-10K; Supplier 5: Digi-Key; Supplier Part Number 5: 541-2980-1-ND; Supplier 6: LCSC
R51 = R_2.21k_0603_0.1: Manufacturer: Vishay; Manufacturer Part Number: RV0603E2211BNT; Voltage: 50V; Power: 125mW; Tolerance: 0.1%; Part Number: R_2.21k_0603_0.1; HelpURL: https://datasheet.octopart.com/RV0603E2211BNT-Vishay-datasheet-17360820.pdf; Supplier 1: TME; Supplier 2: RS Components; Supplier 3: Farnell; Supplier Part Number 3: 2352724; Supplier 4: Mouser; Supplier 5: Digi-Key; Supplier Part Number 5: 716-RV0603E2211BNTTR-ND; Supplier 6: LCSC
U7 = VS_TPSM84209RKHT: 4.5-V to 28-V Input, 1.2-V to 6-V Output, 2.5-A Power Module; Manufacturer: Texas Instruments; Manufacturer Part Number: TPSM84209RKHT; Supplier 1: *; Supplier Part Number 1: *

## Sheet PCB_LED_CALENDAR__SINGLE_YEAR_DIGIT.SchDoc: LED CALENDAR
size A4; Author: Andrzej Laczewski; DrawnBy: Andrzej Laczewski; SheetNumber: 3; SheetTotal: 4
Used 4 times, as channels YD_1, YD_2, YD_3, YD_4. Parts and nets are listed once, with the designators drawn on the sheet.
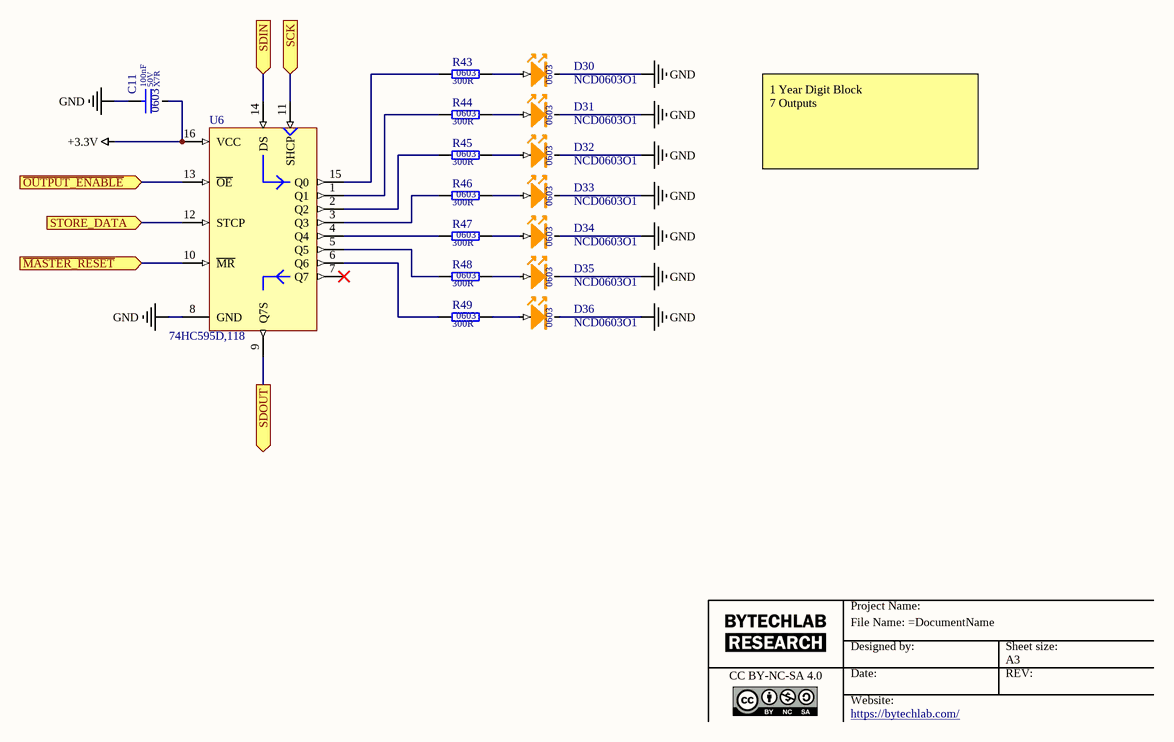
[diagram p4: PCB_LED_CALENDAR__SINGLE_YEAR_DIGIT.SchDoc]

### Parts
C11  value 100nF  Dielectric: X7R  Voltage: 50V  SCH_Footprint: 0603  [C_0603_1608]  (hidden comment: Ceramic X7R)
D30  NCD0603O1  SCH_Footprint: 0603  [LED_0603]
D31  NCD0603O1  SCH_Footprint: 0603  [LED_0603]
D32  NCD0603O1  SCH_Footprint: 0603  [LED_0603]
D33  NCD0603O1  SCH_Footprint: 0603  [LED_0603]
D34  NCD0603O1  SCH_Footprint: 0603  [LED_0603]
D35  NCD0603O1  SCH_Footprint: 0603  [LED_0603]
D36  NCD0603O1  SCH_Footprint: 0603  [LED_0603]
R43  value 300R  SCH_Footprint: 0603  [R_0603_1608]  (hidden comment: Resistor)
R44  value 300R  SCH_Footprint: 0603  [R_0603_1608]  (hidden comment: Resistor)
R45  value 300R  SCH_Footprint: 0603  [R_0603_1608]  (hidden comment: Resistor)
R46  value 300R  SCH_Footprint: 0603  [R_0603_1608]  (hidden comment: Resistor)
R47  value 300R  SCH_Footprint: 0603  [R_0603_1608]  (hidden comment: Resistor)
R48  value 300R  SCH_Footprint: 0603  [R_0603_1608]  (hidden comment: Resistor)
R49  value 300R  SCH_Footprint: 0603  [R_0603_1608]  (hidden comment: Resistor)
U6  74HC595D,118  [SO16]

### Ports
SCK (in), SDIN (in), SDOUT (out), STORE_DATA (in), ~{MASTER_RESET} (in), ~{OUTPUT_ENABLE} (in)

### Nets
+3.3V: C11.2 U6.16(VCC)
GND: C11.1 D30.1(K) D31.1(K) D32.1(K) D33.1(K) D34.1(K) D35.1(K) D36.1(K) U6.8(GND)
~{MASTER_RESET}: U6.10(~{MR}) ; port ~{MASTER_RESET}
~{OUTPUT_ENABLE}: U6.13(~{OE}) ; port ~{OUTPUT_ENABLE}
SCK: U6.11(SHCP) ; port SCK
SDIN: U6.14(DS) ; port SDIN
SDOUT: U6.9(Q7S) ; port SDOUT
STORE_DATA: U6.12(STCP) ; port STORE_DATA
NetD30_2: D30.2(A) R43.2
NetD31_2: D31.2(A) R44.2
NetD32_2: D32.2(A) R45.2
NetD33_2: D33.2(A) R46.2
NetD34_2: D34.2(A) R47.2
NetD35_2: D35.2(A) R48.2
NetD36_2: D36.2(A) R49.2
NetR43_1: R43.1 U6.15(Q0)
NetR44_1: R44.1 U6.1(Q1)
NetR45_1: R45.1 U6.2(Q2)
NetR46_1: R46.1 U6.3(Q3)
NetR47_1: R47.1 U6.4(Q4)
NetR48_1: R48.1 U6.5(Q5)
NetR49_1: R49.1 U6.6(Q6)

Not connected (* = marked no-connect by the designer): U6 7(Q7)*

### Channels
YD_1: designators end in _YD_1; ports SCK=NetMOD1_5 SDIN=NetU6_YD_1_14 SDOUT=NetU6_YD_1_9 STORE_DATA=NetMOD1_20 ~{MASTER_RESET}=NetMOD1_19 ~{OUTPUT_ENABLE}=NetMOD1_6
YD_2: designators end in _YD_2; ports SCK=NetMOD1_5 SDIN=NetU6_YD_1_9 SDOUT=NetU6_YD_2_9 STORE_DATA=NetMOD1_20 ~{MASTER_RESET}=NetMOD1_19 ~{OUTPUT_ENABLE}=NetMOD1_6
YD_3: designators end in _YD_3; ports SCK=NetMOD1_5 SDIN=NetU6_YD_2_9 SDOUT=NetU6_YD_3_9 STORE_DATA=NetMOD1_20 ~{MASTER_RESET}=NetMOD1_19 ~{OUTPUT_ENABLE}=NetMOD1_6
YD_4: designators end in _YD_4; ports SCK=NetMOD1_5 SDIN=NetU6_YD_3_9 SDOUT=NetU6_YD_4_9 STORE_DATA=NetMOD1_20 ~{MASTER_RESET}=NetMOD1_19 ~{OUTPUT_ENABLE}=NetMOD1_6

### Notes on the sheet
- 1 Year Digit Block
  7 Outputs
- Project Name:
- File Name: =DocumentName
- CC BY-NC-SA 4.0
- Designed by:
- Date:
- Website:
- Sheet size:
- A3
- REV:
- https://bytechlab.com/
- Title:
- from project
- Sheet:
- of
- Revision
- Author:
- File name:
- Checked by:
- Size:
- A2
- Approved by:

### Library data of the parts
C11 = C_100nF_50V_X7R_0603_5: as C27 on sheet PCB_LED_CALENDAR__SINGLE_MONTH_31D; Part Number: C_100nF_50V_X7R_0603_5; HelpURL: http://www.tme.eu/pl/Document/4a42202b32dab16128fe107dd69598cc/samsung-chip-cap.pdf; Supplier 1: TME; Supplier Part Number 1: CL10B104JB8NNNC; Supplier 2: RS Components; Supplier Part Number 2: 7665455; Supplier 3: Farnell; Supplier 4: Mouser; Supplier 5: Digi-Key; Supplier Part Number 5: 1276-1033-1-ND; Supplier 6: LCSC; Supplier Part Number 6: C24452
D30-D36 = OL_NCD0603O1: as D67 on sheet PCB_LED_CALENDAR__SINGLE_MONTH_31D; Manufacturer Part Number: NCD0603O1; Supplier 1: JLCPCB; Supplier Part Number 1: C84269
R43-R49 = R_300R_0603_1: as R83 on sheet PCB_LED_CALENDAR__SINGLE_MONTH_31D; Part Number: R_300R_0603_1; HelpURL: https://www.tme.eu/Document/d2a72e545e5c8eb7bf2a04fa97535928/rc0603yageo.pdf; Supplier 1: TME; Supplier Part Number 1: RC0603FR-07300R; Supplier 2: RS Components; Supplier 3: Farnell; Supplier Part Number 3: 2413696; Supplier 4: Mouser; Supplier Part Number 4: 603-RC0603FR-07300RL; Supplier 5: Digi-Key; Supplier Part Number 5: 311-300HRCT-ND; Supplier 6: LCSC
U6 = U_74HC595D,118: as U12 on sheet PCB_LED_CALENDAR__SINGLE_MONTH_31D; Manufacturer Part Number: 74HC595D,118; Supplier 1: JLCPCB; Supplier Part Number 1: C5947

## Sheet PCB_LED_CALENDAR__ESP-12E.SchDoc: LED CALENDAR
size A3
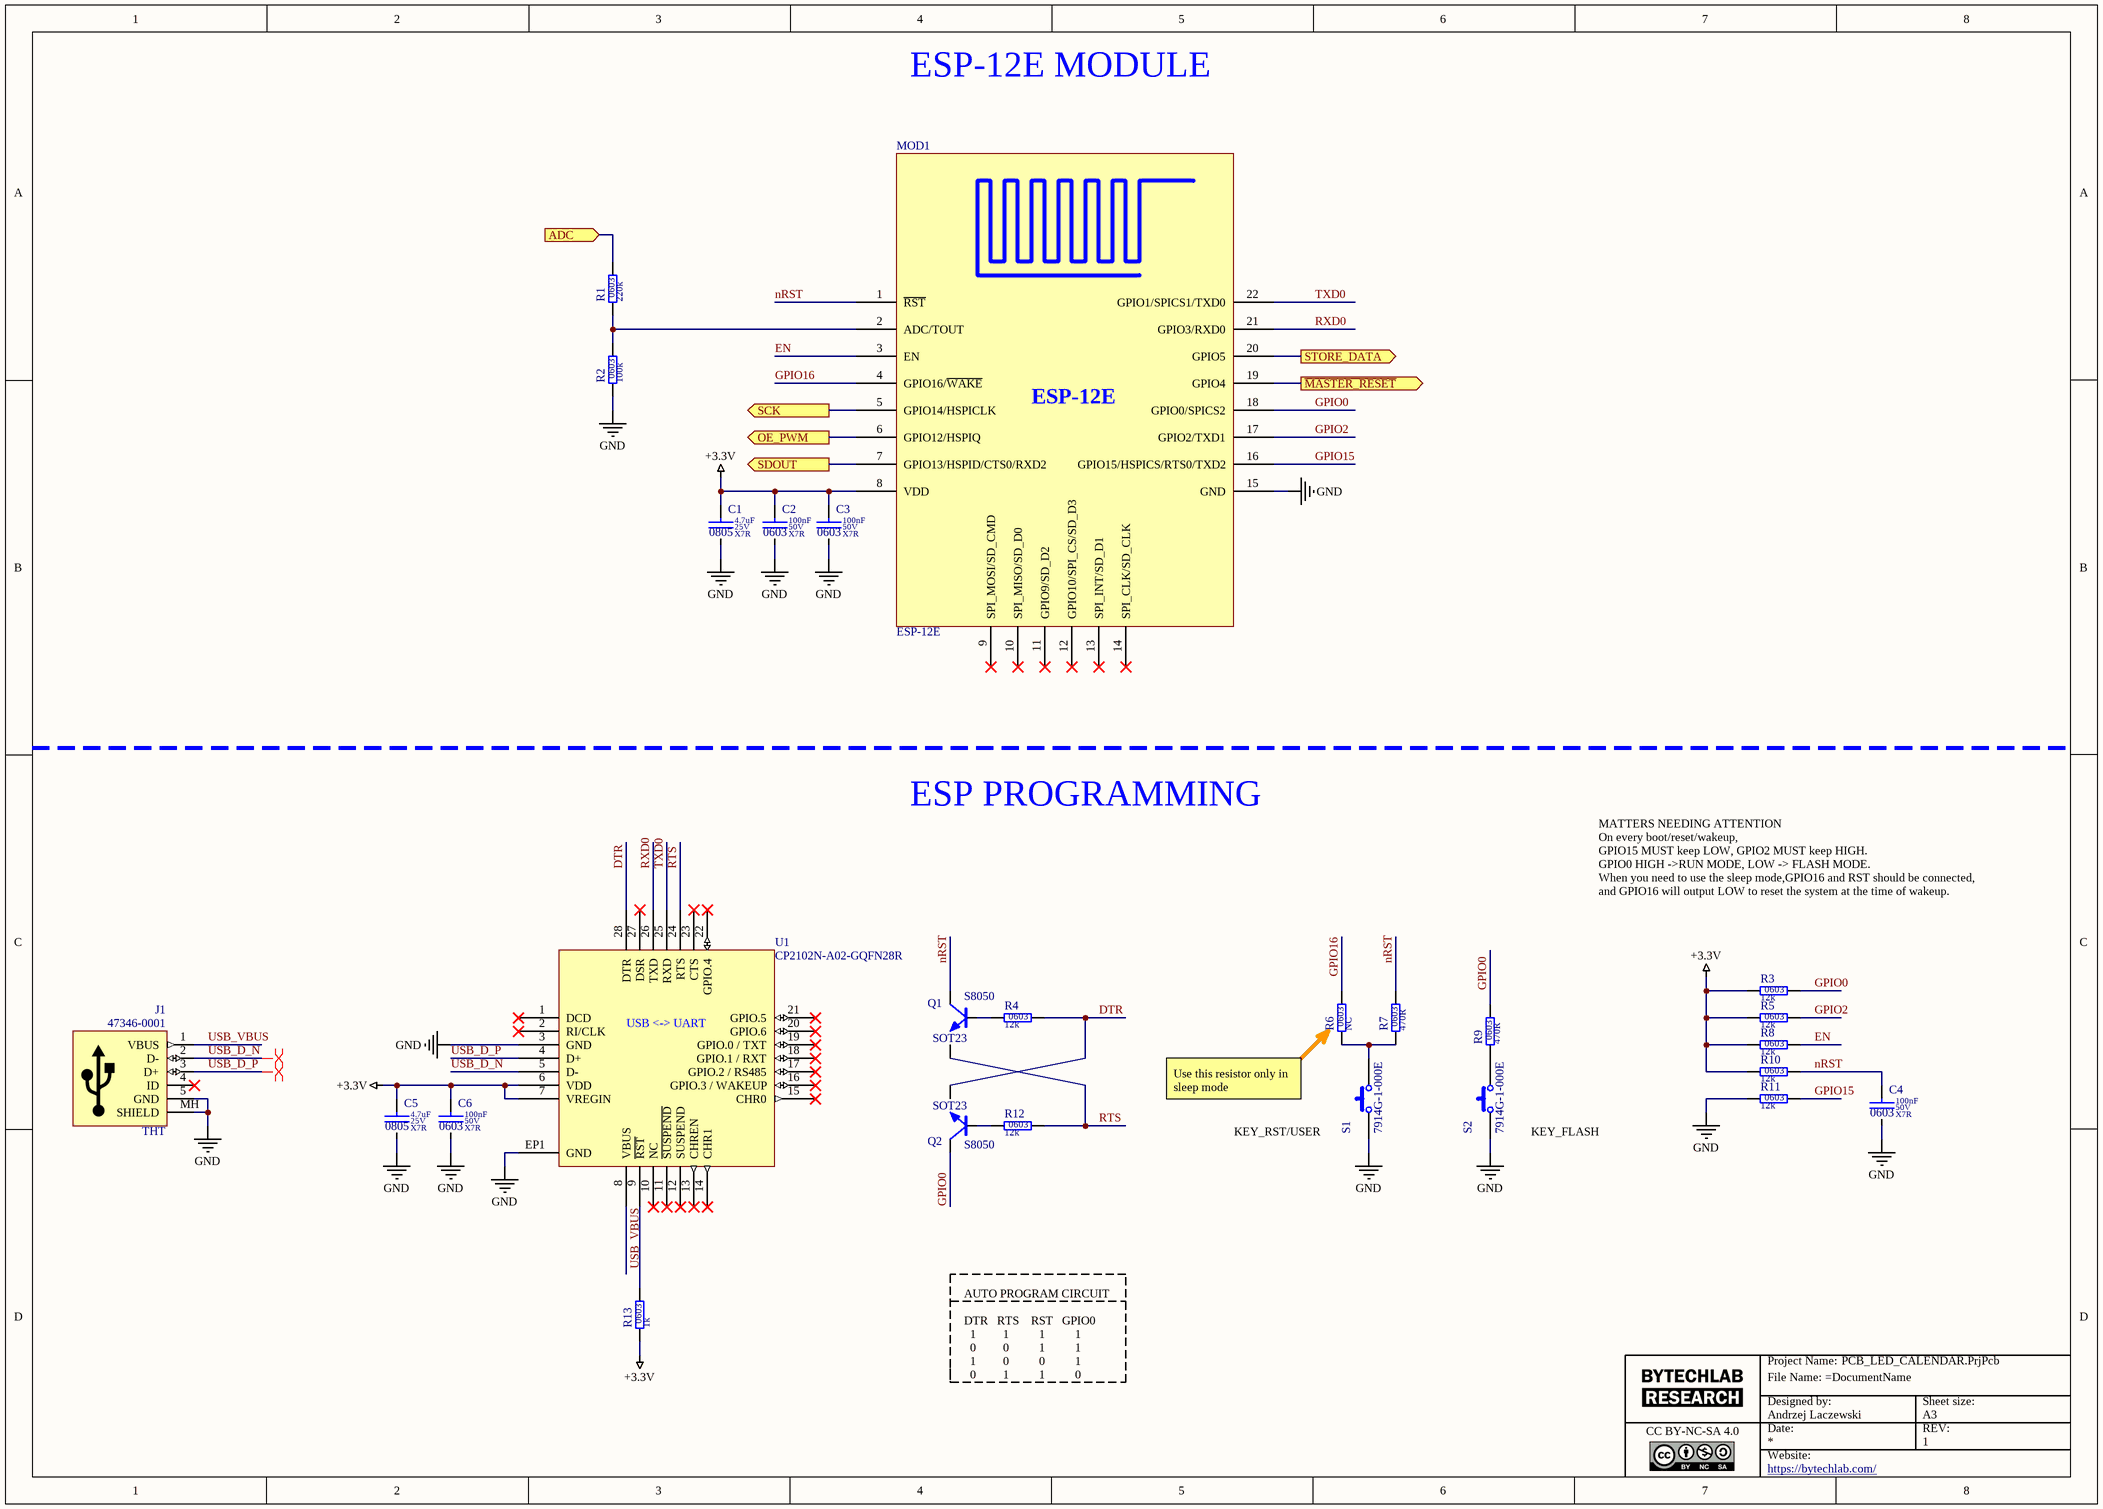
[diagram p5: PCB_LED_CALENDAR__ESP-12E.SchDoc]

### Parts
C1  value 4.7uF  Dielectric: X7R  Voltage: 25V  SCH_Footprint: 0805  [C_0805_2012]  (hidden comment: Ceramic X7R)
C2  value 100nF  Dielectric: X7R  Voltage: 50V  SCH_Footprint: 0603  [C_0603_1608]  (hidden comment: Ceramic X7R)
C3  value 100nF  Dielectric: X7R  Voltage: 50V  SCH_Footprint: 0603  [C_0603_1608]  (hidden comment: Ceramic X7R)
C4  value 100nF  Dielectric: X7R  Voltage: 50V  SCH_Footprint: 0603  [C_0603_1608]  (hidden comment: Ceramic X7R)
C5  value 4.7uF  Dielectric: X7R  Voltage: 25V  SCH_Footprint: 0805  [C_0805_2012]  (hidden comment: Ceramic X7R)
C6  value 100nF  Dielectric: X7R  Voltage: 50V  SCH_Footprint: 0603  [C_0603_1608]  (hidden comment: Ceramic X7R)
J1  value 47346-0001  SCH_Footprint: THT  [J_USB_MICROB_47346-0001]  (hidden comment: USB connector)
MOD1  ESP-12E  [ESP-12E]
Q1  S8050  SCH_Footprint: SOT23  [SOT-23]
Q2  S8050  SCH_Footprint: SOT23  [SOT-23]
R1  value 220k  SCH_Footprint: 0603  [R_0603_1608]  (hidden comment: Resistor)
R2  value 100k  SCH_Footprint: 0603  [R_0603_1608]  (hidden comment: Resistor)
R3  value 12k  SCH_Footprint: 0603  [R_0603_1608]  (hidden comment: Resistor)
R4  value 12k  SCH_Footprint: 0603  [R_0603_1608]  (hidden comment: Resistor)
R5  value 12k  SCH_Footprint: 0603  [R_0603_1608]  (hidden comment: Resistor)
R6  value NC  SCH_Footprint: 0603  [R_NC_0603_1608]  (hidden comment: Resistor)
R7  value 470R  SCH_Footprint: 0603  [R_0603_1608]  (hidden comment: Resistor)
R8  value 12k  SCH_Footprint: 0603  [R_0603_1608]  (hidden comment: Resistor)
R9  value 470R  SCH_Footprint: 0603  [R_0603_1608]  (hidden comment: Resistor)
R10  value 12k  SCH_Footprint: 0603  [R_0603_1608]  (hidden comment: Resistor)
R11  value 12k  SCH_Footprint: 0603  [R_0603_1608]  (hidden comment: Resistor)
R12  value 12k  SCH_Footprint: 0603  [R_0603_1608]  (hidden comment: Resistor)
R13  value 1k  SCH_Footprint: 0603  [R_0603_1608]  (hidden comment: Resistor)
S1  7914G-1-000E  [7914G-1-000E]
S2  7914G-1-000E  [7914G-1-000E]
U1  CP2102N-A02-GQFN28R  [QFN28]

### Ports
ADC (in), OE_PWM (out), SCK (out), SDOUT (out), STORE_DATA (out), ~{MASTER_RESET} (out)

### Nets
+3.3V: C1.1 C2.1 C3.1 C5.1 C6.1 MOD1.8(VDD) R3.1 R5.1 R8.1 R10.1 R13.1 U1.6(VDD) U1.7(VREGIN)
GND: C1.2 C2.2 C3.2 C4.2 C5.2 C6.2 J1.5(GND) J1.MH(SHIELD) MOD1.15(GND) R2.1 R11.1 S1.1 S2.1 U1.3(GND) U1.EP1(GND)
DTR: Q2.E R4.2 U1.28(DTR)
EN: MOD1.3(EN) R8.2
GPIO0: MOD1.18(GPIO0/SPICS2) Q2.C R3.2 R9.2
GPIO2: MOD1.17(GPIO2/TXD1) R5.2
GPIO15: MOD1.16(GPIO15/HSPICS/RTS0/TXD2) R11.2
GPIO16: MOD1.4(GPIO16/~{WAKE}) R6.2
nRST: C4.1 MOD1.1(~{RST}) Q1.C R7.2 R10.2
RTS: Q1.E R12.2 U1.24(RTS)
RXD0: MOD1.21(GPIO3/RXD0) U1.26(TXD)
TXD0: MOD1.22(GPIO1/SPICS1/TXD0) U1.25(RXD)
USB_D_N: J1.2(D-) U1.5(D-)
USB_D_P: J1.3(D+) U1.4(D+)
USB_VBUS: J1.1(VBUS) U1.8(VBUS)
NetMOD1_2: MOD1.2(ADC/TOUT) R1.1 R2.2
NetMOD1_5: MOD1.5(GPIO14/HSPICLK) ; port SCK
NetMOD1_6: MOD1.6(GPIO12/HSPIQ) ; port OE_PWM
NetMOD1_7: MOD1.7(GPIO13/HSPID/CTS0/RXD2) ; port SDOUT
NetMOD1_19: MOD1.19(GPIO4) ; port ~{MASTER_RESET}
NetMOD1_20: MOD1.20(GPIO5) ; port STORE_DATA
NetQ1_B: Q1.B R4.1
NetQ2_B: Q2.B R12.1
NetQL1_2: R1.2 ; port ADC
NetR6_1: R6.1 R7.1 S1.2
NetR9_1: R9.1 S2.2
NetR13_2: R13.2 U1.9(~{RST})

Not connected (* = marked no-connect by the designer): J1 4(ID)*; MOD1 9(SPI_MOSI/SD_CMD)* 10(SPI_MISO/SD_D0)* 11(GPIO9/SD_D2)* 12(GPIO10/SPI_CS/SD_D3)* 13(SPI_INT/SD_D1)* 14(SPI_CLK/SD_CLK)*; U1 1(DCD)* 2(RI/CLK)* 10(NC)* 11(~{SUSPEND})* 12(SUSPEND)* 13(CHREN)* 14(CHR1)* 15(CHR0)* 16(GPIO.3_/_WAKEUP)* 17(GPIO.2_/_RS485)* 18(GPIO.1_/_RXT)* 19(GPIO.0_/_TXT)* 20(GPIO.6)* 21(GPIO.5)* 22(GPIO.4)* 23(CTS)* 27(DSR)*

### Layout directives
differential pair: USB_D_N, USB_D_P

### Notes on the sheet
- ESP-12E MODULE
- ESP PROGRAMMING
- MATTERS NEEDING ATTENTION
  On every boot/reset/wakeup,
  GPIO15 MUST keep LOW, GPIO2 MUST keep HIGH.
  GPIO0 HIGH ->RUN MODE, LOW -> FLASH MODE.
  When you need to use the sleep mode,GPIO16 and RST should be connected,
  and GPIO16 will output LOW to reset the system at the time of wakeup.
- Use this resistor only in sleep mode
- (near S1) KEY_RST/USER
- (near S2) KEY_FLASH
- AUTO PROGRAM CIRCUIT
  DTR   RTS    RST   GPIO0
  1         1          1          1
  0         0          1          1
  1         0          0          1
  0         1          1          0
- Project Name:
- File Name: =DocumentName
- CC BY-NC-SA 4.0
- Designed by:
- Date:
- Website:
- Sheet size:
- A3
- REV:
- https://bytechlab.com/
- (in symbol U_CP2102N-A02-GQFN28R) USB <-> UART

### Library data of the parts
C1 C5 = C_4.7uF_25V_X7R_0805_10: Capacitor; Manufacturer: TDK; Manufacturer Part Number: CGA4J1X7R1E475K125AC; Tolerance (%): 10; Part Number: C_4.7uF_25V_X7R_0805_10; HelpURL: https://product.tdk.com/info/en/catalog/datasheets/mlcc_automotive_general_en.pdf; Supplier 1: TME; Supplier 2: RS Components; Supplier Part Number 2: 9155187P; Supplier 3: Farnell; Supplier Part Number 3: 2346968; Supplier 4: Mouser; Supplier Part Number 4: 810-CGA4J1X7R1E475K; Supplier 5: Digi-Key; Supplier Part Number 5: 445-6967-1-ND; Supplier 6: LCSC; Supplier 7: Avnet; Supplier Part Number 7: CGA4J1X7R1E475K125AC
C2-C4 C6 = C_100nF_50V_X7R_0603_5: as C27 on sheet PCB_LED_CALENDAR__SINGLE_MONTH_31D; Part Number: C_100nF_50V_X7R_0603_5; HelpURL: http://www.tme.eu/pl/Document/4a42202b32dab16128fe107dd69598cc/samsung-chip-cap.pdf; Supplier 1: TME; Supplier Part Number 1: CL10B104JB8NNNC; Supplier 2: RS Components; Supplier Part Number 2: 7665455; Supplier 3: Farnell; Supplier 4: Mouser; Supplier 5: Digi-Key; Supplier Part Number 5: 1276-1033-1-ND; Supplier 6: LCSC; Supplier Part Number 6: C24452
J1 = J_USB_MICROB_47346-0001: USB A THT Connector; Manufacturer: Molex; Part Number: J_USB_MICROB_47346-0001; HelpURL: http://www.farnell.com/datasheets/2214755.pdf?_ga=2.122698443.1358013891.1513863851-953128292.1508669538; Manufacturer Part Number: 47346-0001; Supplier 1: TME; Supplier 2: RS Components; Supplier 3: Farnell; Supplier Part Number 3: 1568026; Supplier 4: Mouser; Supplier Part Number 4: 538-47346-0001; Supplier 5: Digi-Key; Supplier 6: LCSC
MOD1 = MOD_ESP_12_E: ESP-12E Wi-Fi Module by AI-Thinker; Manufacturer Part Number: ESP-12E; Manufacturer: Ai-thinker; Supplier 1: JLCPCB; Supplier Part Number 1: C89297
Q1 Q2 = QNP_S8050: 25V 300mW 500mA NPN SOT-23 Bipolar (BJT) ROHS; Manufacturer: FUXINSEMI; Manufacturer Part Number: S8050; Supplier 1: JLCPCB; Supplier Part Number 1: C908252
R1 = R_220k_0603_1: Manufacturer: Vishay; Manufacturer Part Number: CRCW0603220KFKTABC; Voltage: 75V; Power: 100mW; Tolerance: 1%; Part Number: R_220k_0603_1; HelpURL: https://www.tme.eu/Document/622e28308c06d160637f2b14751ba16b/Data%20Sheet%20CRCW_BCe3.pdf; Supplier 1: TME; Supplier Part Number 1: CRCW0603220KFKTABC; Supplier 2: RS Components; Supplier 3: Farnell; Supplier 4: Mouser; Supplier 5: Digi-Key; Supplier 6: LCSC
R2 = R_100k_0603_1: Manufacturer: Royalohm; Manufacturer Part Number: 0603SAF1003T5E; Voltage: 50V; Power: 100mW; Tolerance: 1%; Part Number: R_100k_0603_1; HelpURL: http://www.tme.eu/pl/Document/b315665a56acbc42df513c99b390ad98/ROYALOHM-THICKFILM.pdf; Supplier 1: TME; Supplier Part Number 1: SMD0603-100K-1%; Supplier 2: RS Components; Supplier 3: Farnell; Supplier 4: Mouser; Supplier Part Number 4: 667-ERJ-3EKF1003V; Supplier 5: Digi-Key; Supplier Part Number 5: P100KHCT-ND; Supplier 6: LCSC
R3-R5 R8 R10-R12 = R_12k_0603_1: Manufacturer: Yageo; Manufacturer Part Number: RC0603FR-0712KL; Voltage: 50V; Power: 100mW; Tolerance: 1%; Part Number: R_12k_0603_1; HelpURL: http://www.tme.eu/pl/Document/d2a72e545e5c8eb7bf2a04fa97535928/rc0603yageo.pdf; Supplier 1: TME; Supplier Part Number 1: RC0603FR-0712K; Supplier 2: RS Components; Supplier 3: Farnell; Supplier Part Number 3: 2693657; Supplier 4: Mouser; Supplier Part Number 4: 603-RC0603FR-0712KL; Supplier 5: Digi-Key; Supplier Part Number 5: 311-12.0KHRCT-ND; Supplier 6: LCSC
R6 = R_GENERIC_0603: Part Number: R_GENERIC_0603; HelpURL: -; Manufacturer: -; Manufacturer Part Number: -; Supplier 1: TME; Supplier 2: RS Components; Supplier 3: Farnell; Supplier 4: Mouser; Supplier 5: Digi-Key; Supplier 6: LCSC
R7 R9 = R_470R_0603_1: Manufacturer: Yageo; Manufacturer Part Number: RC0603FR-07470RL; Voltage: 50V; Power: 100mW; Tolerance: 1%; Part Number: R_470R_0603_1; HelpURL: http://www.tme.eu/en/Document/9fef8ccbb584e9f6a1c931cf356afd5c/PYu-RC0603_51_RoHS_L_4.pdf; Supplier 1: TME; Supplier Part Number 1: RC0603FR-07470R; Supplier 2: RS Components; Supplier 3: Farnell; Supplier Part Number 3: 9238441; Supplier 4: Mouser; Supplier Part Number 4: 603-RC0603FR-07470RL; Supplier 5: Digi-Key; Supplier Part Number 5: 311-470HRCT-ND; Supplier 6: LCSC
R13 = R_1k_0603_1: Manufacturer: Vishay; Manufacturer Part Number: CRCW06031K00FKEA; Voltage: 75V; Power: 100mW; Tolerance: 1%; Part Number: R_1k_0603_1; HelpURL: http://www.farnell.com/datasheets/2310790.pdf?_ga=2.256888843.1690599162.1548417389-1379097396.1542296996&_gac=1.262631934.1547230258.Cj0KCQiAmuHhBRD0ARIsAFWyPwhX8HcvXnM3tA0ZBodZLzDIjH2ZxLpjT5LWo9bad_HPRbU8LfPq44UaAhEwEALw_wcB; Supplier 1: TME; Supplier 2: RS Components; Supplier Part Number 2: 678-9875P; Supplier 3: Farnell; Supplier Part Number 3: 1469740; Supplier 4: Mouser; Supplier Part Number 4: 71-CRCW0603-1.0K-E3; Supplier 5: Digi-Key; Supplier Part Number 5: 541-1.00KHCT-ND; Supplier 6: LCSC
S1 S2 = S_7914G-1-000E: Tact Switch; Manufacturer: BOURNS; Manufacturer Part Number: 7914G-1-000E; Supplier 1: JLCPCB; Supplier Part Number 1: C840653
U1 = U_CP2102N-A02-GQFN28R: USB to UART UART QFN-28-EP(5x5) USB Converters ROHS; Manufacturer: SKYWORKS/SILICON LABS; Manufacturer Part Number: CP2102N-A02-GQFN28R; Supplier 1: JLCPCB; Supplier Part Number 1: C964632

## Nets that join several sheets
+3.3V: 30D_3 (8 pins), 31D_6 (8 pins), 30D_4 (8 pins), 31D_7 (8 pins), 31D_5 (8 pins), 31D_4 (8 pins), 30D_2 (8 pins), 31D_3 (8 pins), 30D_1 (8 pins), 31D_2 (8 pins), 29D_1 (8 pins), 31D_1 (8 pins), PCB_LED_CALENDAR__AMBIENT_LIGHT_SENS (QL1.1), PCB_LED_CALENDAR__POWER (8 pins), YD_1 (C11_YD_1.2 U6_YD_1.16), PCB_LED_CALENDAR__ESP-12E (13 pins), YD_2 (C11_YD_2.2 U6_YD_2.16), YD_3 (C11_YD_3.2 U6_YD_3.16), YD_4 (C11_YD_4.2 U6_YD_4.16)
GND: 30D_3 (39 pins), 31D_6 (39 pins), 30D_4 (39 pins), 31D_7 (39 pins), 31D_5 (39 pins), 31D_4 (39 pins), 30D_2 (39 pins), 31D_3 (39 pins), 30D_1 (39 pins), 31D_2 (39 pins), 29D_1 (39 pins), 31D_1 (39 pins), PCB_LED_CALENDAR__AMBIENT_LIGHT_SENS (R52.1), PCB_LED_CALENDAR__POWER (14 pins), YD_1 (9 pins), PCB_LED_CALENDAR__ESP-12E (15 pins), YD_2 (9 pins), YD_3 (9 pins), YD_4 (9 pins)
NetMOD1_5: 30D_3 (U12_30D_3.11 U13_30D_3.11 U14_30D_3.11 U15_30D_3.11), 31D_6 (U12_31D_6.11 U13_31D_6.11 U14_31D_6.11 U15_31D_6.11), 30D_4 (U12_30D_4.11 U13_30D_4.11 U14_30D_4.11 U15_30D_4.11), 31D_7 (U12_31D_7.11 U13_31D_7.11 U14_31D_7.11 U15_31D_7.11), 31D_5 (U12_31D_5.11 U13_31D_5.11 U14_31D_5.11 U15_31D_5.11), 31D_4 (U12_31D_4.11 U13_31D_4.11 U14_31D_4.11 U15_31D_4.11), 30D_2 (U12_30D_2.11 U13_30D_2.11 U14_30D_2.11 U15_30D_2.11), 31D_3 (U12_31D_3.11 U13_31D_3.11 U14_31D_3.11 U15_31D_3.11), 30D_1 (U12_30D_1.11 U13_30D_1.11 U14_30D_1.11 U15_30D_1.11), 31D_2 (U12_31D_2.11 U13_31D_2.11 U14_31D_2.11 U15_31D_2.11), 29D_1 (U12_29D_1.11 U13_29D_1.11 U14_29D_1.11 U15_29D_1.11), 31D_1 (U12_31D_1.11 U13_31D_1.11 U14_31D_1.11 U15_31D_1.11), YD_1 (U6_YD_1.11), PCB_LED_CALENDAR__ESP-12E (MOD1.5), YD_2 (U6_YD_2.11), YD_3 (U6_YD_3.11), YD_4 (U6_YD_4.11)
NetMOD1_6: 30D_3 (U12_30D_3.13 U13_30D_3.13 U14_30D_3.13 U15_30D_3.13), 31D_6 (U12_31D_6.13 U13_31D_6.13 U14_31D_6.13 U15_31D_6.13), 30D_4 (U12_30D_4.13 U13_30D_4.13 U14_30D_4.13 U15_30D_4.13), 31D_7 (U12_31D_7.13 U13_31D_7.13 U14_31D_7.13 U15_31D_7.13), 31D_5 (U12_31D_5.13 U13_31D_5.13 U14_31D_5.13 U15_31D_5.13), 31D_4 (U12_31D_4.13 U13_31D_4.13 U14_31D_4.13 U15_31D_4.13), 30D_2 (U12_30D_2.13 U13_30D_2.13 U14_30D_2.13 U15_30D_2.13), 31D_3 (U12_31D_3.13 U13_31D_3.13 U14_31D_3.13 U15_31D_3.13), 30D_1 (U12_30D_1.13 U13_30D_1.13 U14_30D_1.13 U15_30D_1.13), 31D_2 (U12_31D_2.13 U13_31D_2.13 U14_31D_2.13 U15_31D_2.13), 29D_1 (U12_29D_1.13 U13_29D_1.13 U14_29D_1.13 U15_29D_1.13), 31D_1 (U12_31D_1.13 U13_31D_1.13 U14_31D_1.13 U15_31D_1.13), YD_1 (U6_YD_1.13), PCB_LED_CALENDAR__ESP-12E (MOD1.6), YD_2 (U6_YD_2.13), YD_3 (U6_YD_3.13), YD_4 (U6_YD_4.13)
NetMOD1_7: 31D_1 (U12_31D_1.14), PCB_LED_CALENDAR__ESP-12E (MOD1.7)
NetMOD1_19: 30D_3 (U12_30D_3.10 U13_30D_3.10 U14_30D_3.10 U15_30D_3.10), 31D_6 (U12_31D_6.10 U13_31D_6.10 U14_31D_6.10 U15_31D_6.10), 30D_4 (U12_30D_4.10 U13_30D_4.10 U14_30D_4.10 U15_30D_4.10), 31D_7 (U12_31D_7.10 U13_31D_7.10 U14_31D_7.10 U15_31D_7.10), 31D_5 (U12_31D_5.10 U13_31D_5.10 U14_31D_5.10 U15_31D_5.10), 31D_4 (U12_31D_4.10 U13_31D_4.10 U14_31D_4.10 U15_31D_4.10), 30D_2 (U12_30D_2.10 U13_30D_2.10 U14_30D_2.10 U15_30D_2.10), 31D_3 (U12_31D_3.10 U13_31D_3.10 U14_31D_3.10 U15_31D_3.10), 30D_1 (U12_30D_1.10 U13_30D_1.10 U14_30D_1.10 U15_30D_1.10), 31D_2 (U12_31D_2.10 U13_31D_2.10 U14_31D_2.10 U15_31D_2.10), 29D_1 (U12_29D_1.10 U13_29D_1.10 U14_29D_1.10 U15_29D_1.10), 31D_1 (U12_31D_1.10 U13_31D_1.10 U14_31D_1.10 U15_31D_1.10), YD_1 (U6_YD_1.10), PCB_LED_CALENDAR__ESP-12E (MOD1.19), YD_2 (U6_YD_2.10), YD_3 (U6_YD_3.10), YD_4 (U6_YD_4.10)
NetMOD1_20: 30D_3 (U12_30D_3.12 U13_30D_3.12 U14_30D_3.12 U15_30D_3.12), 31D_6 (U12_31D_6.12 U13_31D_6.12 U14_31D_6.12 U15_31D_6.12), 30D_4 (U12_30D_4.12 U13_30D_4.12 U14_30D_4.12 U15_30D_4.12), 31D_7 (U12_31D_7.12 U13_31D_7.12 U14_31D_7.12 U15_31D_7.12), 31D_5 (U12_31D_5.12 U13_31D_5.12 U14_31D_5.12 U15_31D_5.12), 31D_4 (U12_31D_4.12 U13_31D_4.12 U14_31D_4.12 U15_31D_4.12), 30D_2 (U12_30D_2.12 U13_30D_2.12 U14_30D_2.12 U15_30D_2.12), 31D_3 (U12_31D_3.12 U13_31D_3.12 U14_31D_3.12 U15_31D_3.12), 30D_1 (U12_30D_1.12 U13_30D_1.12 U14_30D_1.12 U15_30D_1.12), 31D_2 (U12_31D_2.12 U13_31D_2.12 U14_31D_2.12 U15_31D_2.12), 29D_1 (U12_29D_1.12 U13_29D_1.12 U14_29D_1.12 U15_29D_1.12), 31D_1 (U12_31D_1.12 U13_31D_1.12 U14_31D_1.12 U15_31D_1.12), YD_1 (U6_YD_1.12), PCB_LED_CALENDAR__ESP-12E (MOD1.20), YD_2 (U6_YD_2.12), YD_3 (U6_YD_3.12), YD_4 (U6_YD_4.12)
NetQL1_2: PCB_LED_CALENDAR__AMBIENT_LIGHT_SENS (QL1.2 R52.2), PCB_LED_CALENDAR__ESP-12E (R1.2)
NetU6_YD_1_9: YD_1 (U6_YD_1.9), YD_2 (U6_YD_2.14)
NetU6_YD_1_14: 31D_7 (U15_31D_7.9), YD_1 (U6_YD_1.14)
NetU6_YD_2_9: YD_2 (U6_YD_2.9), YD_3 (U6_YD_3.14)
NetU6_YD_3_9: YD_3 (U6_YD_3.9), YD_4 (U6_YD_4.14)
NetU12_29D_1_14: 29D_1 (U12_29D_1.14), 31D_1 (U15_31D_1.9)
NetU12_30D_1_14: 30D_1 (U12_30D_1.14), 31D_2 (U15_31D_2.9)
NetU12_30D_2_14: 30D_2 (U12_30D_2.14), 31D_3 (U15_31D_3.9)
NetU12_30D_3_14: 30D_3 (U12_30D_3.14), 31D_5 (U15_31D_5.9)
NetU12_30D_4_14: 31D_6 (U15_31D_6.9), 30D_4 (U12_30D_4.14)
NetU12_31D_2_14: 31D_2 (U12_31D_2.14), 29D_1 (U15_29D_1.9)
NetU12_31D_3_14: 31D_3 (U12_31D_3.14), 30D_1 (U15_30D_1.9)
NetU12_31D_4_14: 31D_4 (U12_31D_4.14), 30D_2 (U15_30D_2.9)
NetU12_31D_5_14: 31D_5 (U12_31D_5.14), 31D_4 (U15_31D_4.9)
NetU12_31D_6_14: 30D_3 (U15_30D_3.9), 31D_6 (U12_31D_6.14)
NetU12_31D_7_14: 30D_4 (U15_30D_4.9), 31D_7 (U12_31D_7.14)